# EAGLE design BillyBassBoard (EAGLE 9.6.2)

## Sheet 1 of 4
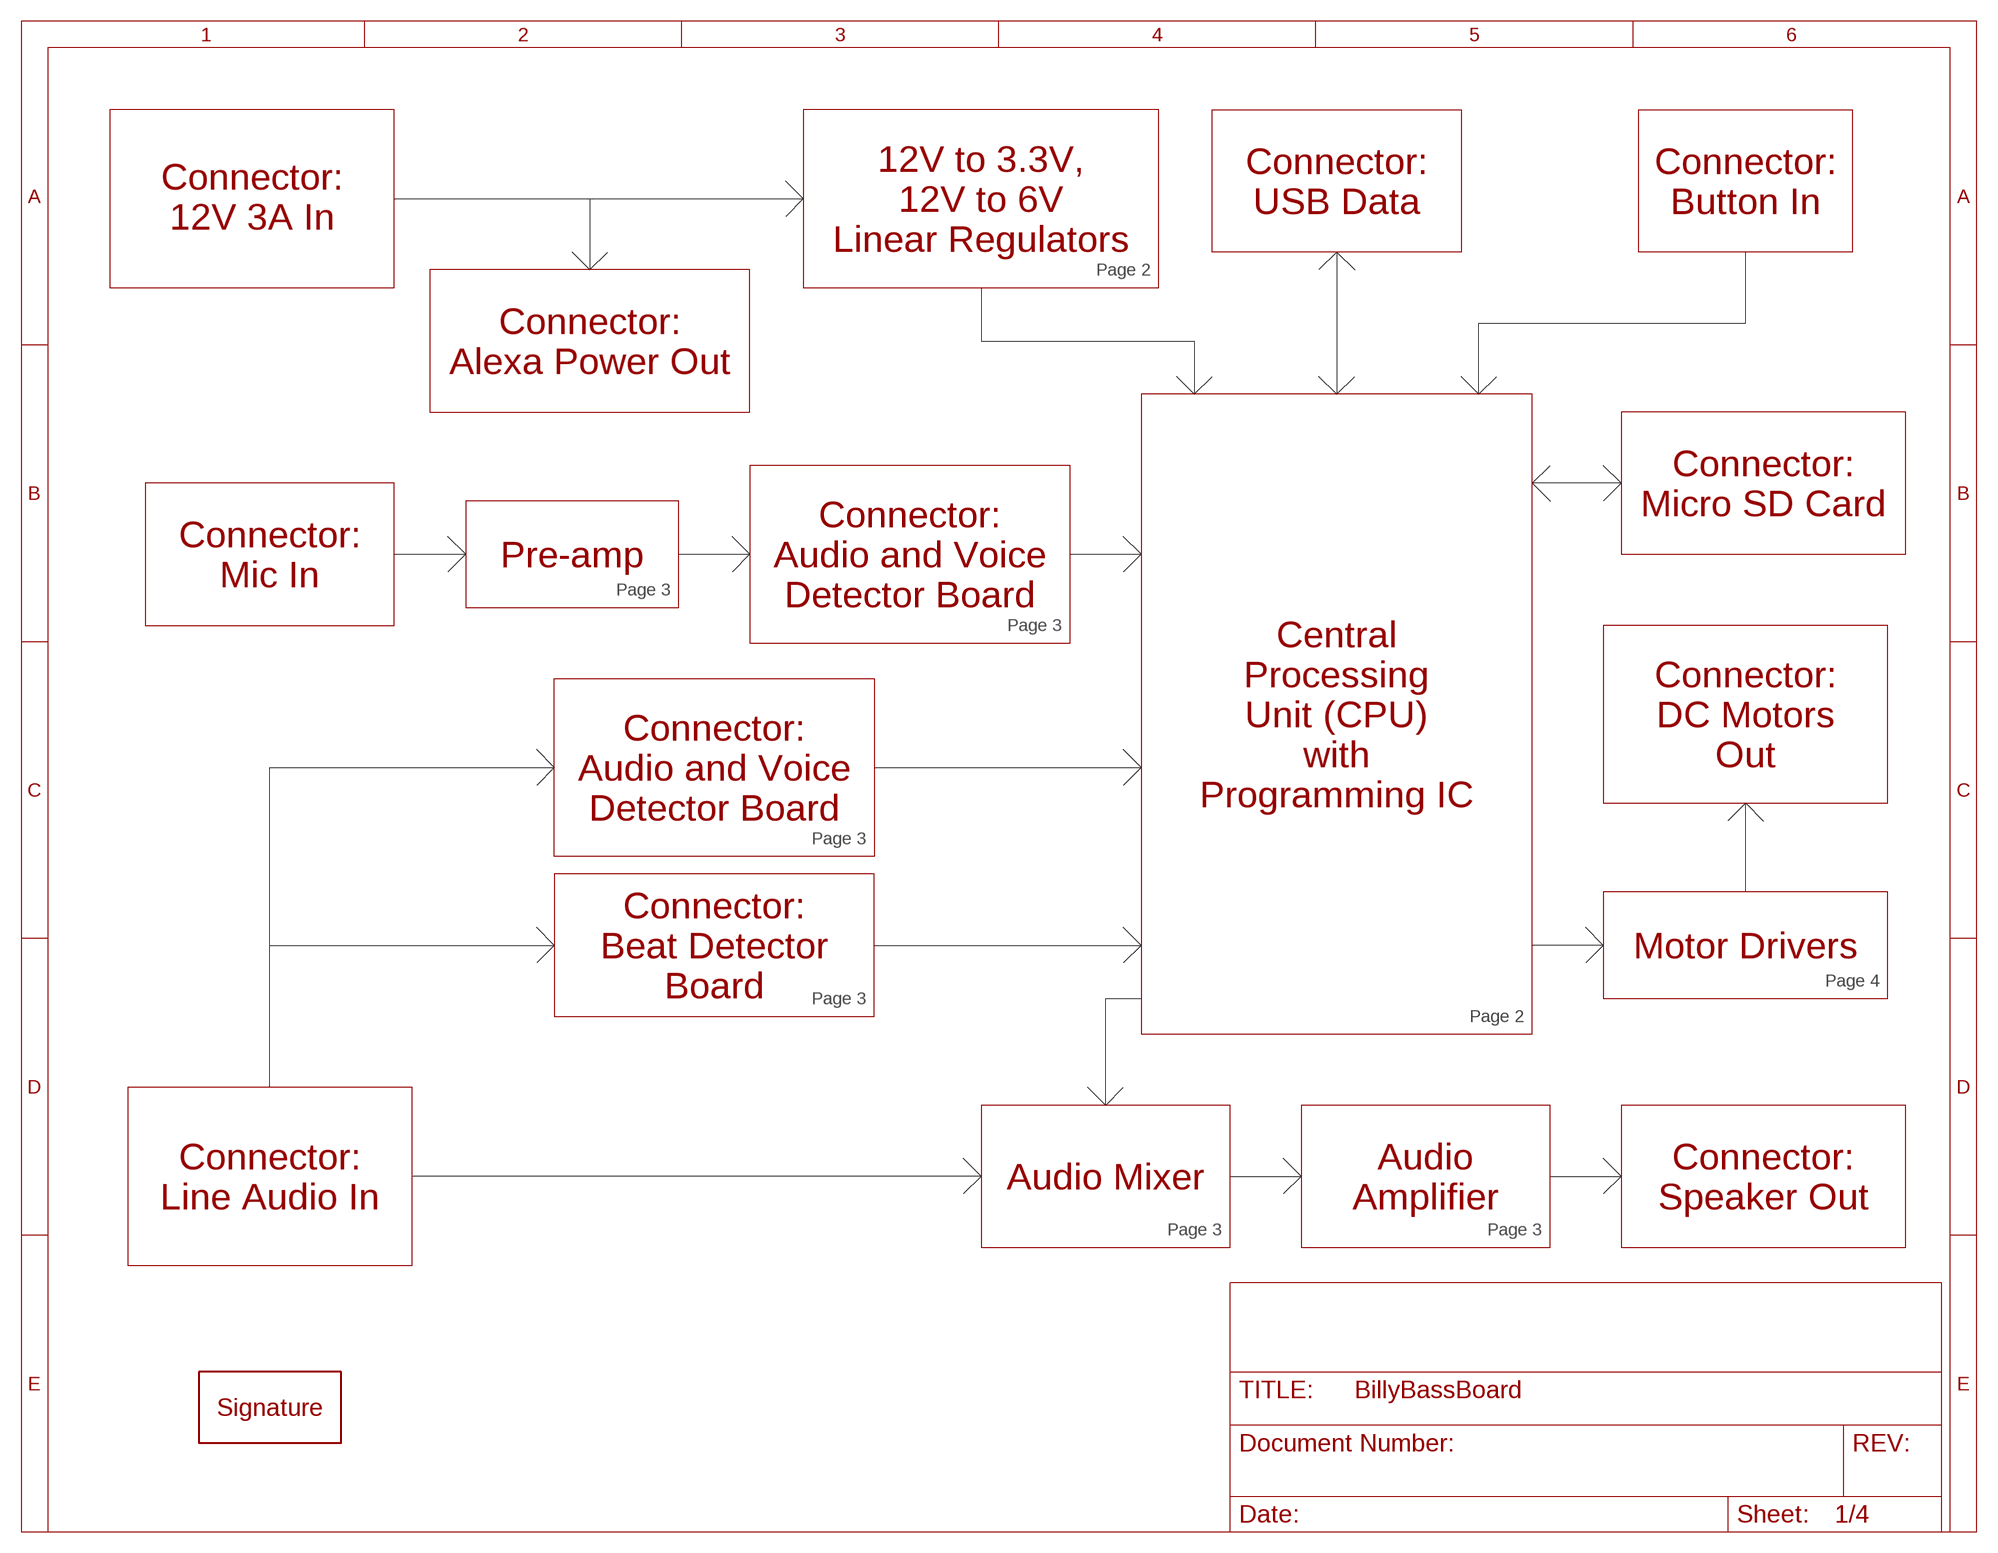
[diagram p0: schematic, sheet 1]

### Parts
U$122  SIGNATURE  [SIGNATURE]

### Notes on the sheet
- Connector:
  USB Data
- Connector:
  Button In
- 12V to 3.3V,
  12V to 6V
  Linear Regulators
- Connector:
  12V 3A In
- Page 2
- Connector:
  Alexa Power Out
- Connector:
  Micro SD Card
- Connector:
  Mic In
- Pre-amp
- Connector:
  Audio and Voice
  Detector Board
- Page 3
- Page 3
- Central
  Processing
  Unit (CPU)
  with
  Programming IC
- Connector:
  DC Motors
  Out
- Connector:
  Audio and Voice
  Detector Board
- Page 3
- Connector:
  Beat Detector
  Board
- Motor Drivers
- Page 4
- Page 3
- Page 2
- Connector:
  Line Audio In
- Audio Mixer
- Audio
  Amplifier
- Connector:
  Speaker Out
- Page 3 | Page 3

## Sheet 2 of 4
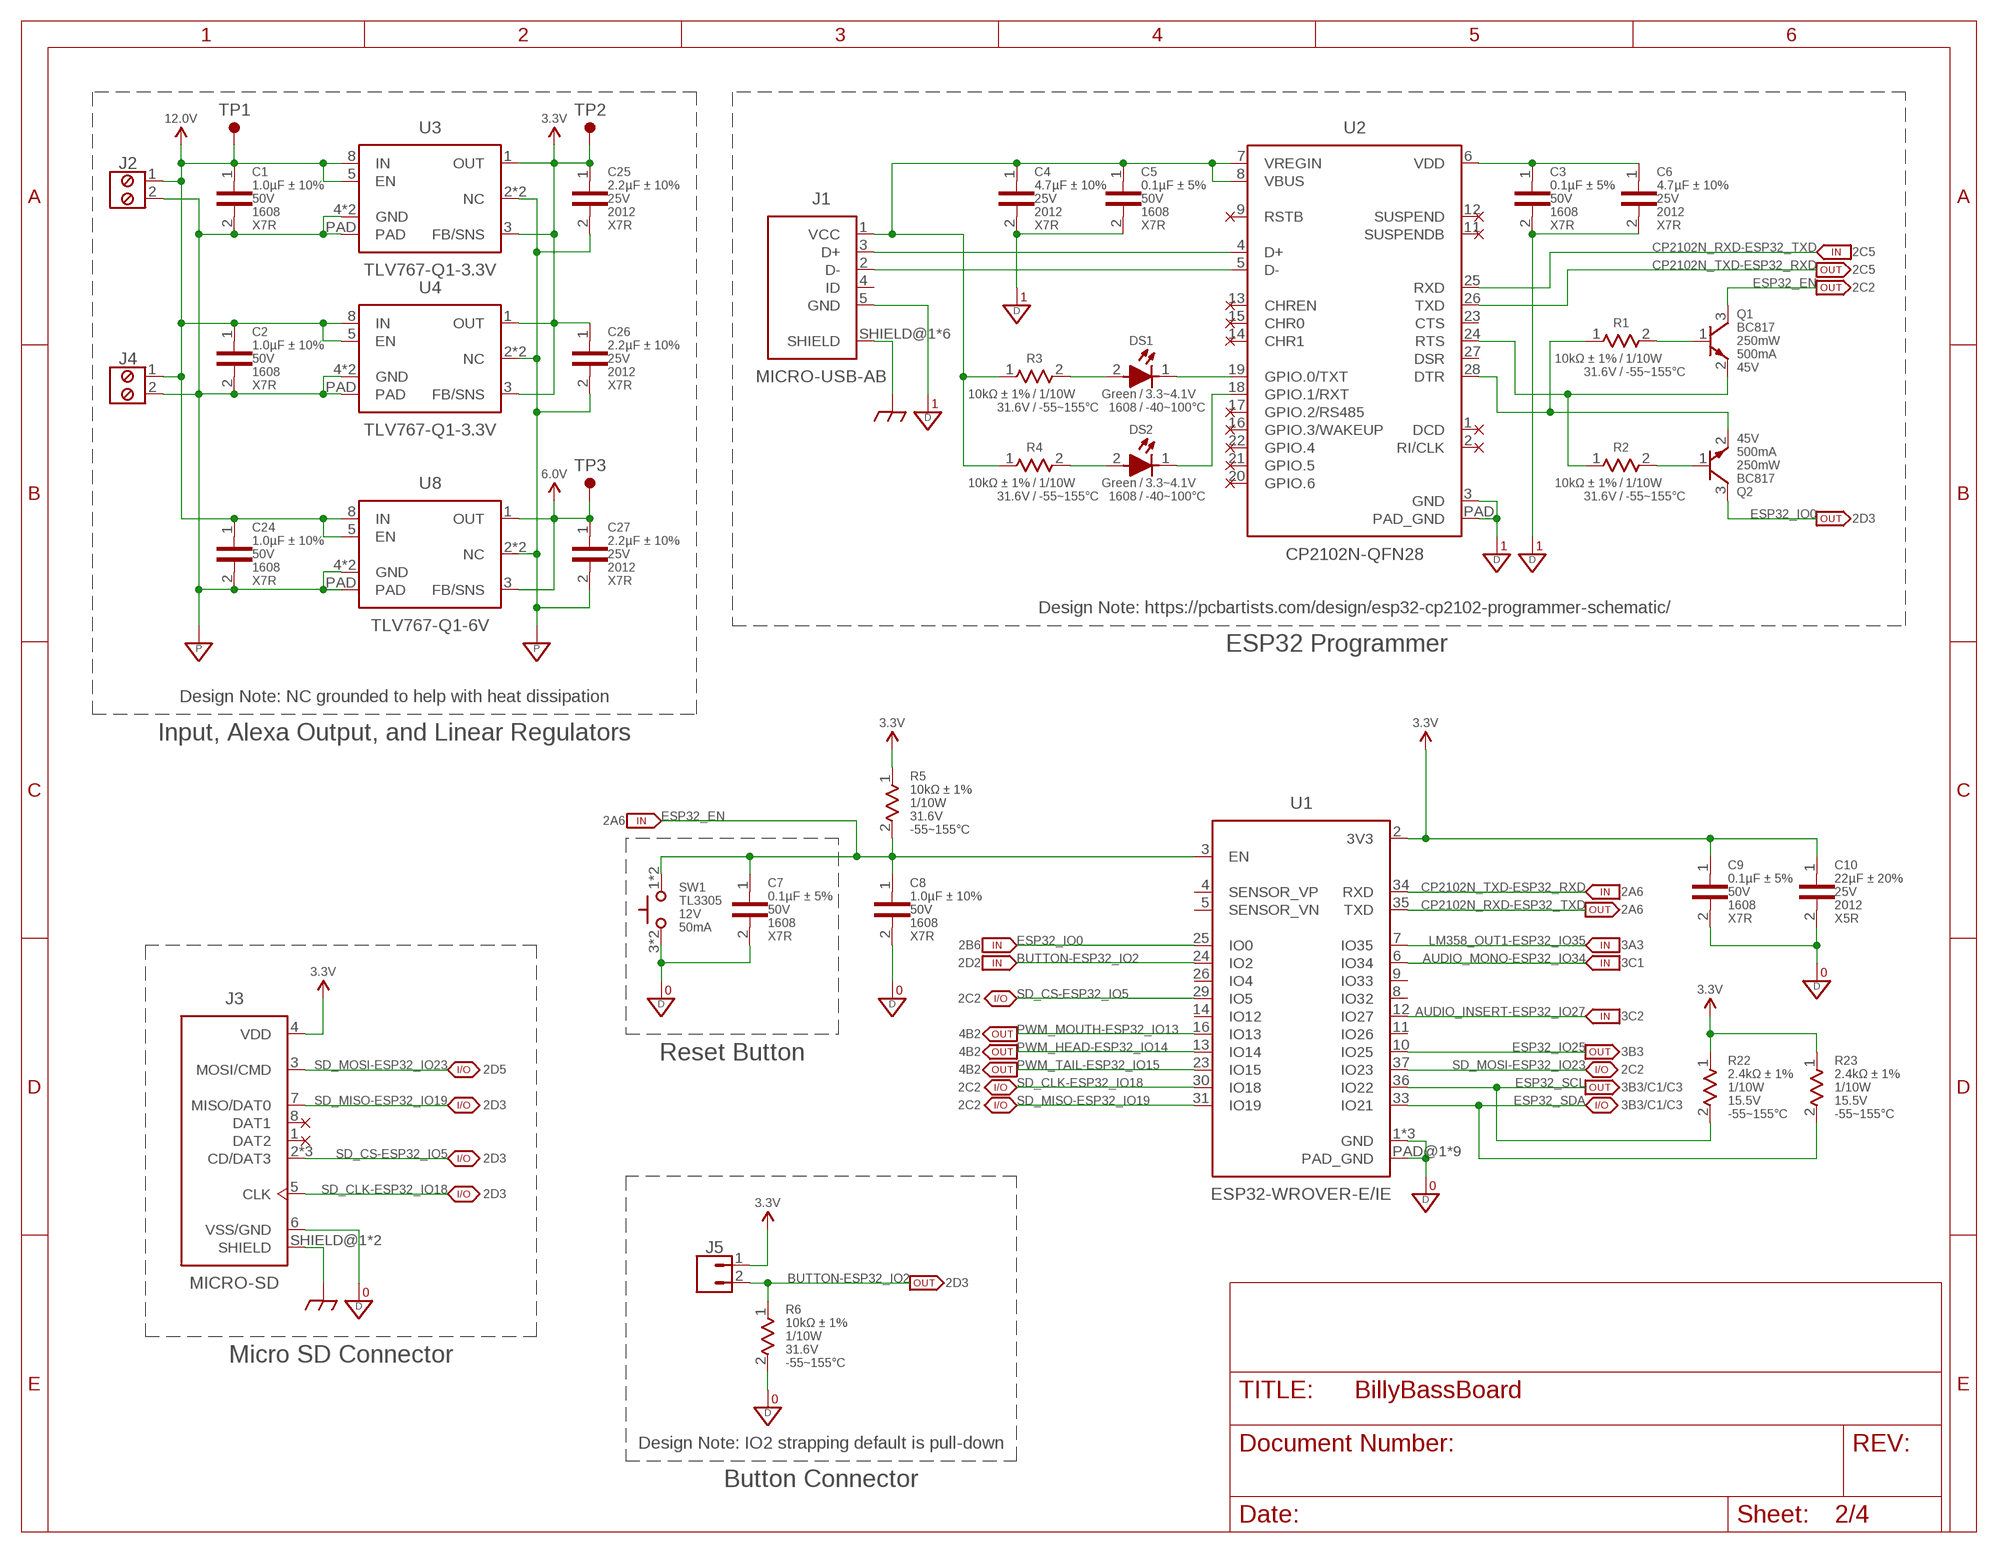
[diagram p1: schematic, sheet 2]

### Parts
C1  1.0µF ± 10%  CAP-V-1.0UF-1608  [1608-SEM]
C2  1.0µF ± 10%  CAP-V-1.0UF-1608  [1608-SEM]
C3  0.1µF ± 5%  CAP-V-0.1UF-1608  [1608-SEM]
C4  4.7µF ± 10%  CAP-V-4.7UF-2012  [2012-SEM]
C5  0.1µF ± 5%  CAP-V-0.1UF-1608  [1608-SEM]
C6  4.7µF ± 10%  CAP-V-4.7UF-2012  [2012-SEM]
C7  0.1µF ± 5%  CAP-V-0.1UF-1608  [1608-SEM]
C8  1.0µF ± 10%  CAP-V-1.0UF-1608  [1608-SEM]
C9  0.1µF ± 5%  CAP-V-0.1UF-1608  [1608-SEM]
C10  22µF ± 20%  CAP-V-22UF-2012  [2012-SEM]
C24  1.0µF ± 10%  CAP-V-1.0UF-1608  [1608-SEM]
C25  2.2µF ± 10%  CAP-V-2.2UF-2012  [2012-SEM]
C26  2.2µF ± 10%  CAP-V-2.2UF-2012  [2012-SEM]
C27  2.2µF ± 10%  CAP-V-2.2UF-2012  [2012-SEM]
DS1  Green  LED-H-GREEN-1608  [1608]
DS2  Green  LED-H-GREEN-1608  [1608]
J1  MICRO-USB-AB  [47589-0001]
J2  MPT-2-SCREW  [MPT-0.5/2-2.54]
J3  MICRO-SD  [MEM2061]
J4  MPT-2-SCREW  [MPT-0.5/2-2.54]
J5  JST-XH-2  [B2B-XH-A]
Q1  BC817  BJT-NPN-BC817  [SOT-23]
Q2  BC817  BJT-NPN-BC817  [SOT-23]
R1  10kΩ ± 1%  RES-H-10K-1608  [1608-SEM]
R2  10kΩ ± 1%  RES-H-10K-1608  [1608-SEM]
R3  10kΩ ± 1%  RES-H-10K-1608  [1608-SEM]
R4  10kΩ ± 1%  RES-H-10K-1608  [1608-SEM]
R5  10kΩ ± 1%  RES-V-10K-1608  [1608-SEM]
R6  10kΩ ± 1%  RES-V-10K-1608  [1608-SEM]
R22  2.4kΩ ± 1%  RES-V-2.4K-1608  [1608-SEM]
R23  2.4kΩ ± 1%  RES-V-2.4K-1608  [1608-SEM]
SW1  TL3305  BUTTON-V-SPST-TL3305  [TL3305]
TP1  TEST-POINT  [TEST-POINT]
TP2  TEST-POINT  [TEST-POINT]
TP3  TEST-POINT  [TEST-POINT]
U1  ESP32-WROVER-E/IE  [ESP32-WROVER-E/IE]
U2  CP2102N-QFN28  [QFN28]
U3  TLV767-Q1-3.3V  [VSON]
U4  TLV767-Q1-3.3V  [VSON]
U8  TLV767-Q1-6V  [VSON]

### Nets
3.3V: C9.1 C10.1 C25.1 C26.1 J3.4(VDD) J5.1 R5.1 R22.1 R23.1 TP2.TP U1.2(3V3) U3.1(OUT) U3.3(FB/SNS) U4.1(OUT) U4.3(FB/SNS) ; also sheet 3
6.0V: C27.1 TP3.TP U8.1(OUT) U8.3(FB/SNS) ; also sheet 3,4
12.0V: C1.1 C2.1 C24.1 J2.1 J4.1 TP1.TP U3.5(EN) U3.8(IN) U4.5(EN) U4.8(IN) U8.5(EN) U8.8(IN)
AUDIO_INSERT-ESP32_IO27: U1.12(IO27) ; also sheet 3
AUDIO_MONO-ESP32_IO34: U1.6(IO34) ; also sheet 3
BUTTON-ESP32_IO2: J5.2 R6.1 U1.24(IO2)
CHASSIS: J1.SHIELD@1(SHIELD) J1.SHIELD@2(SHIELD) J1.SHIELD@3(SHIELD) J1.SHIELD@4(SHIELD) J1.SHIELD@5(SHIELD) J1.SHIELD@6(SHIELD) J3.SHIELD@1(SHIELD) J3.SHIELD@2(SHIELD) ; also sheet 3
CP2102N_D+: J1.3(D+) U2.4(D+)
CP2102N_D-: J1.2(D-) U2.5(D-)
CP2102N_DTR: Q2.2(E) R1.1 U2.28(DTR)
CP2102N_RTS: Q1.2(E) R2.1 U2.24(RTS)
CP2102N_RXD-ESP32_TXD: U1.35(TXD) U2.25(RXD)
CP2102N_RXT: DS2.1 U2.18(GPIO.1/RXT)
CP2102N_TXD-ESP32_RXD: U1.34(RXD) U2.26(TXD)
CP2102N_TXT: DS1.1 U2.19(GPIO.0/TXT)
CP2102N_VBUS: C4.1 C5.1 J1.1(VCC) R3.1 R4.1 U2.7(VREGIN) U2.8(VBUS)
CP2102N_VDD: C3.1 C6.1 U2.6(VDD)
DGND-0: C7.2 C8.2 C9.2 C10.2 J3.6(VSS/GND) R6.2 SW1.3 SW1.4 U1.1(GND) U1.15(GND) U1.38(GND) U1.PAD@1(PAD_GND) U1.PAD@2(PAD_GND) U1.PAD@3(PAD_GND) U1.PAD@4(PAD_GND) U1.PAD@5(PAD_GND) U1.PAD@6(PAD_GND) U1.PAD@7(PAD_GND) U1.PAD@8(PAD_GND) U1.PAD@9(PAD_GND) ; also sheet 3,4
DGND-1: C3.2 C4.2 C5.2 C6.2 J1.5(GND) U2.3(GND) U2.PAD(PAD_GND) ; also sheet 3
ESP32_EN: C7.1 C8.1 Q1.3(C) R5.2 SW1.1 SW1.2 U1.3(EN)
ESP32_IO0: Q2.3(C) U1.25(IO0)
ESP32_IO25: U1.10(IO25) ; also sheet 3
ESP32_SCL: R22.2 U1.36(IO22) ; also sheet 3
ESP32_SDA: R23.2 U1.33(IO21) ; also sheet 3
LM358_OUT1-ESP32_IO35: U1.7(IO35) ; also sheet 3
N$3: Q1.1(B) R1.2
N$4: Q2.1(B) R2.2
N$5: DS1.2 R3.2
N$6: DS2.2 R4.2
PGND: C1.2 C2.2 C24.2 C25.2 C26.2 C27.2 J2.2 J4.2 U3.2(NC) U3.4(GND) U3.6(GND) U3.7(NC) U3.PAD U4.2(NC) U4.4(GND) U4.6(GND) U4.7(NC) U4.PAD U8.2(NC) U8.4(GND) U8.6(GND) U8.7(NC) U8.PAD ; also sheet 3,4
PWM_HEAD-ESP32_IO14: U1.13(IO14) ; also sheet 4
PWM_MOUTH-ESP32_IO13: U1.16(IO13) ; also sheet 4
PWM_TAIL-ESP32_IO15: U1.23(IO15) ; also sheet 4
SD_CLK-ESP32_IO18: J3.5(CLK) U1.30(IO18)
SD_CS-ESP32_IO5: J3.2(CD/DAT3) J3.CD@1(CD/DAT3) J3.CD@2(CD/DAT3) U1.29(IO5)
SD_MISO-ESP32_IO19: J3.7(MISO/DAT0) U1.31(IO19)
SD_MOSI-ESP32_IO23: J3.3(MOSI/CMD) U1.37(IO23)
Unconnected: J1.4(ID) J3.1(DAT2) J3.8(DAT1) U1.4(SENSOR_VP) U1.5(SENSOR_VN) U1.8(IO32) U1.9(IO33) U1.11(IO26) U1.14(IO12) U1.26(IO4) U2.1(DCD) U2.2(RI/CLK) U2.9(RSTB) U2.11(SUSPENDB) U2.12(SUSPEND) U2.13(CHREN) U2.14(CHR1) U2.15(CHR0) U2.16(GPIO.3/WAKEUP) U2.17(GPIO.2/RS485) U2.20(GPIO.6) U2.21(GPIO.5) U2.22(GPIO.4) U2.23(CTS) U2.27(DSR)

### Notes on the sheet
- 2C5
- 2C5
- 2C2
- 2D3
- Design Note: https://pcbartists.com/design/esp32-cp2102-programmer-schematic/
- ESP32 Programmer
- Design Note: NC grounded to help with heat dissipation
- Input, Alexa Output, and Linear Regulators
- 2A6
- 2A6
- 2A6
- 2B6 | 3A3
- 2D2 | 3C1
- 2C2
- 3C2
- 4B2
- Reset Button | 4B2 | 3B3
- 2D5 | 4B2 | 2C2
- 2C2 | 3B3/C1/C3
- 2D3 | 2C2 | 3B3/C1/C3
- 2D3
- 2D3
- 2D3
- Micro SD Connector
- Design Note: IO2 strapping default is pull-down
- Button Connector

## Sheet 3 of 4
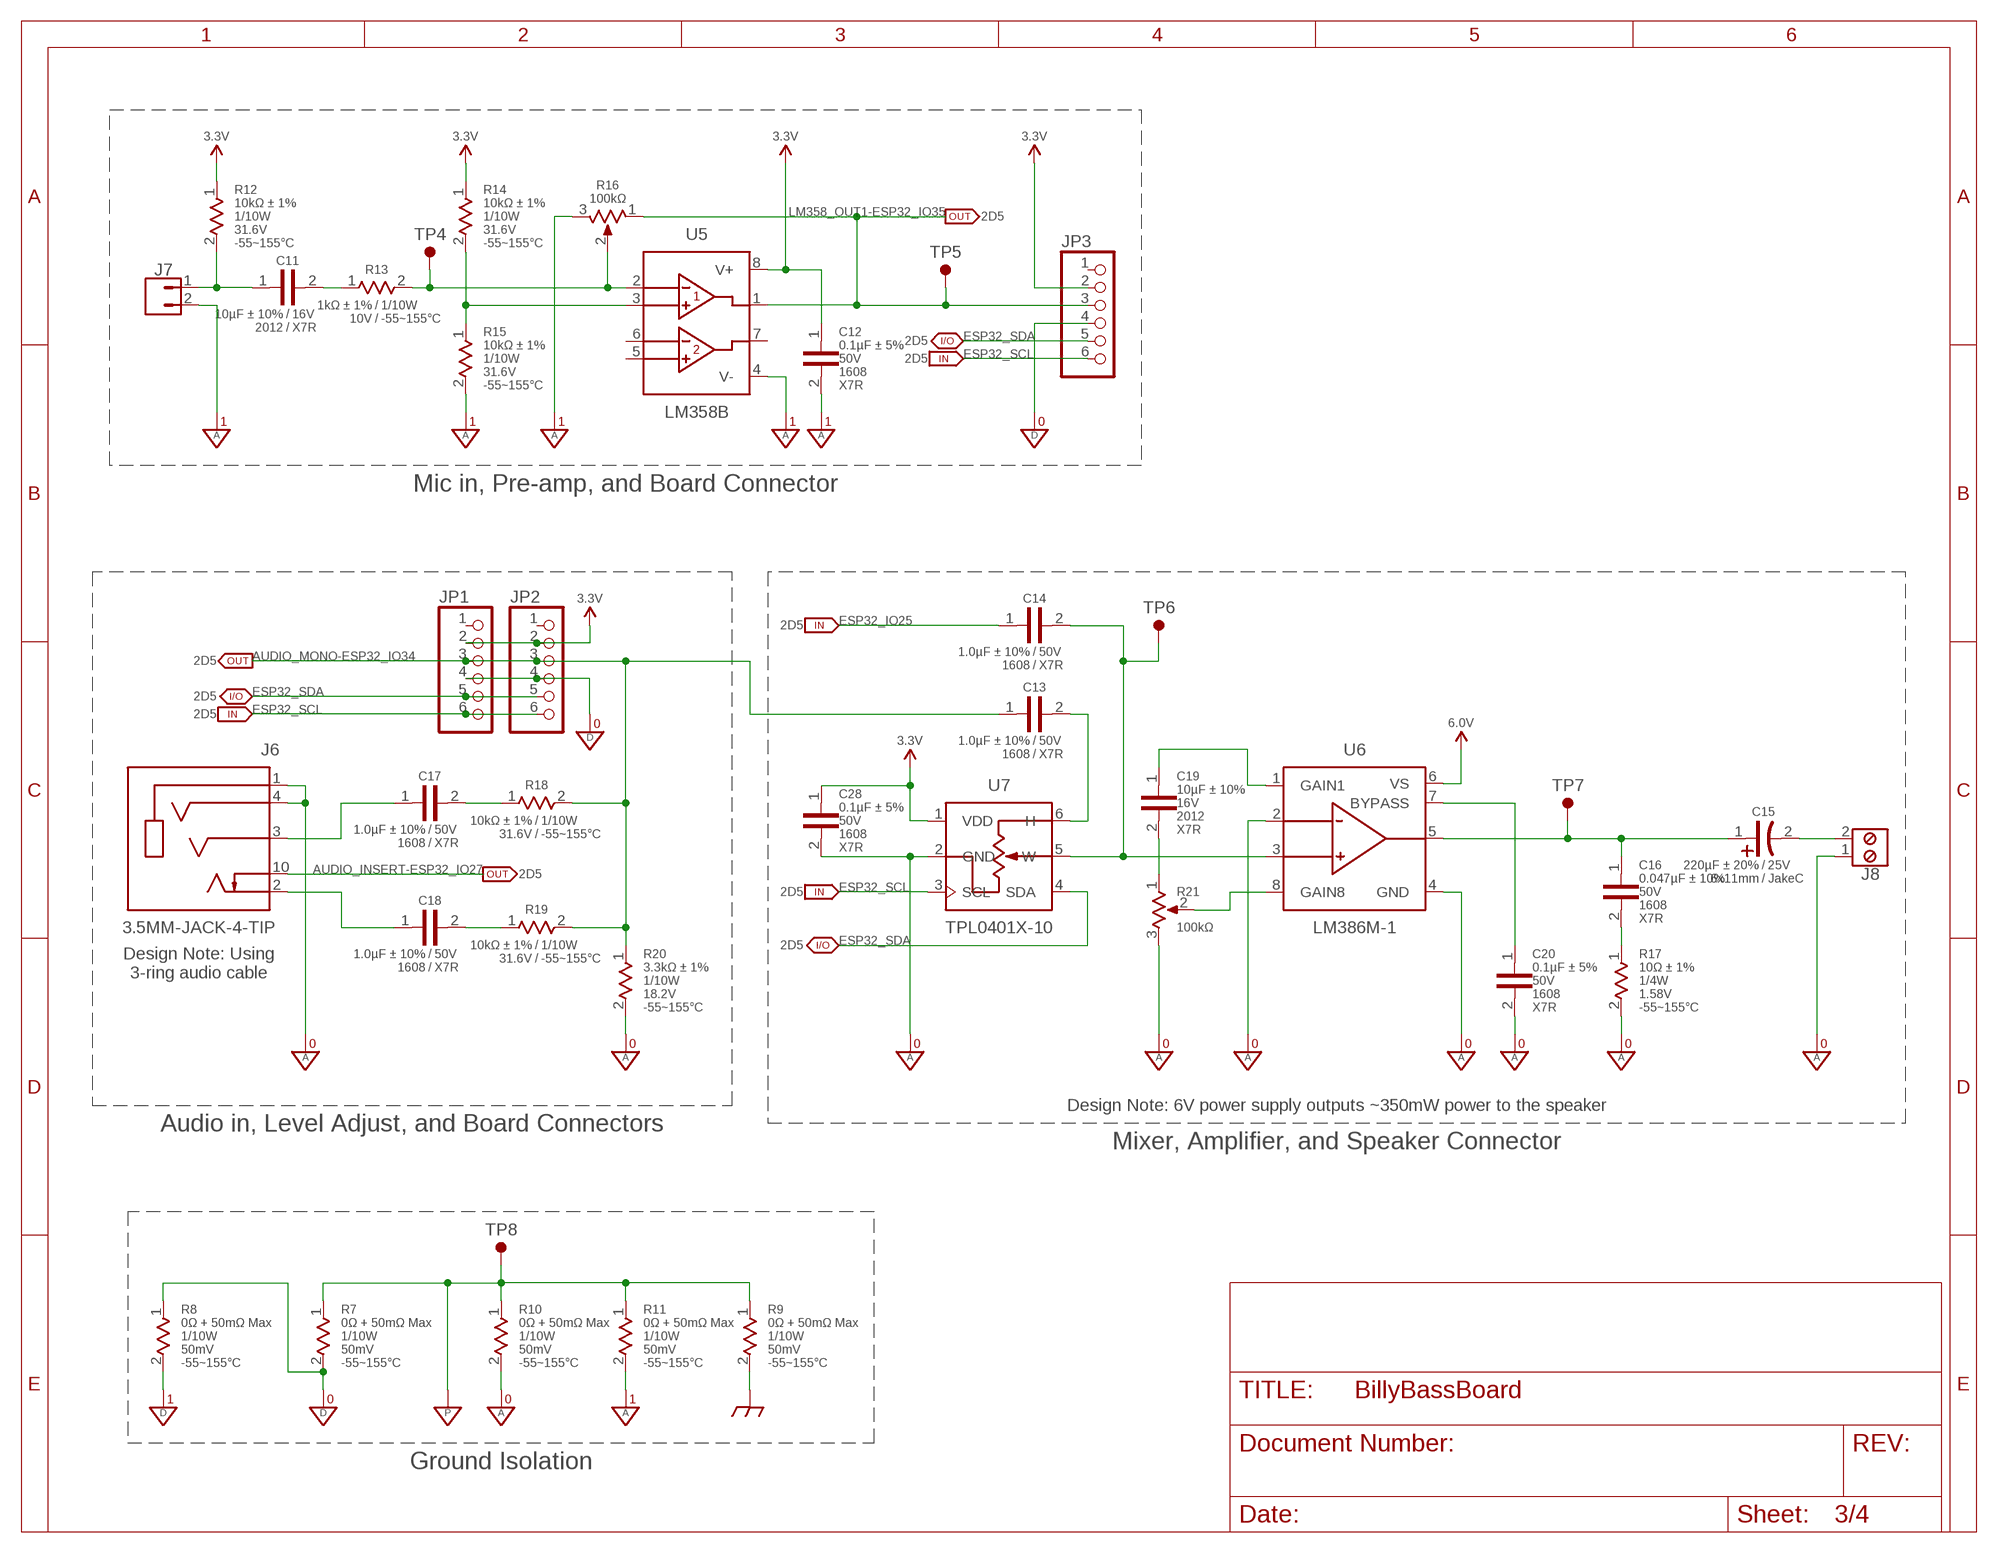
[diagram p2: schematic, sheet 3]

### Parts
C11  10µF ± 10%  CAP-H-10UF-2012  [2012-SEM]
C12  0.1µF ± 5%  CAP-V-0.1UF-1608  [1608-SEM]
C13  1.0µF ± 10%  CAP-H-1.0UF-1608  [1608-SEM]
C14  1.0µF ± 10%  CAP-H-1.0UF-1608  [1608-SEM]
C15  220µF ± 20%  CAP-H-POL-220UF-6X11-E-FLAT-REV  [6X11-E-FLAT-REV]
C16  0.047µF ± 10%  CAP-V-0.047UF-1608  [1608-SEM]
C17  1.0µF ± 10%  CAP-H-1.0UF-1608  [1608-SEM]
C18  1.0µF ± 10%  CAP-H-1.0UF-1608  [1608-SEM]
C19  10µF ± 10%  CAP-V-10UF-2012  [2012-SEM]
C20  0.1µF ± 5%  CAP-V-0.1UF-1608  [1608-SEM]
C28  0.1µF ± 5%  CAP-V-0.1UF-1608  [1608-SEM]
J6  3.5MM-JACK-4-TIP  [SJ2-358940-SMT]
J7  JST-XH-2  [B2B-XH-A]
J8  MPT-2-SCREW  [MPT-0.5/2-2.54]
JP1  PINHD-1X6  [1X06]
JP2  PINHD-1X6  [1X06]
JP3  PINHD-1X6  [1X06]
R7  0Ω + 50mΩ Max  RES-V-0R-1608  [1608-SEM]
R8  0Ω + 50mΩ Max  RES-V-0R-1608  [1608-SEM]
R9  0Ω + 50mΩ Max  RES-V-0R-1608  [1608-SEM]
R10  0Ω + 50mΩ Max  RES-V-0R-1608  [1608-SEM]
R11  0Ω + 50mΩ Max  RES-V-0R-1608  [1608-SEM]
R12  10kΩ ± 1%  RES-V-10K-1608  [1608-SEM]
R13  1kΩ ± 1%  RES-H-1K-1608  [1608-SEM]
R14  10kΩ ± 1%  RES-V-10K-1608  [1608-SEM]
R15  10kΩ ± 1%  RES-V-10K-1608  [1608-SEM]
R16  100kΩ  TRIMPOT-H-100K  [3314J]
R17  10Ω ± 1%  RES-V-10R-3216  [3216-SEM]
R18  10kΩ ± 1%  RES-H-10K-1608  [1608-SEM]
R19  10kΩ ± 1%  RES-H-10K-1608  [1608-SEM]
R20  3.3kΩ ± 1%  RES-V-3.3K-1608  [1608-SEM]
R21  100kΩ  TRIMPOT-V-100K  [3314J]
TP4  TEST-POINT  [TEST-POINT]
TP5  TEST-POINT  [TEST-POINT]
TP6  TEST-POINT  [TEST-POINT]
TP7  TEST-POINT  [TEST-POINT]
TP8  TEST-POINT  [TEST-POINT]
U5  LM358B  [D0008A-SOIC]
U6  LM386M-1  [D0008A-SOIC]
U7  TPL0401X-10  [SC70]

### Nets
3.3V: C12.1 C28.1 JP1.2 JP2.2 JP3.2 R12.1 R14.1 U5.8(V+) U7.1(VDD) ; also sheet 2
6.0V: U6.6(VS) ; also sheet 2,4
AGND-0: C20.2 C28.2 J6.1(SLEEVE) J6.4(RING_2) J8.1 R10.2 R17.2 R20.2 R21.3 U6.2(-INPUT) U6.4(GND) U7.2(GND)
AGND-1: C12.2 J7.2 R11.2 R15.2 R16.3 U5.4(V-)
AUDIO_INSERT-ESP32_IO27: J6.10(TIP_SWITCH) ; also sheet 2
AUDIO_LEFT: C18.1 J6.2(TIP)
AUDIO_MONO-ESP32_IO34: C13.1 JP1.3 JP2.3 R18.2 R19.2 R20.1 ; also sheet 2
AUDIO_RIGHT: C17.1 J6.3(RING_1)
CHASSIS: R9.2 ; also sheet 2
DGND-0: JP1.4 JP2.4 JP3.4 R7.2 R8.1 ; also sheet 2,4
DGND-1: R8.2 ; also sheet 2
ESP32_IO25: C14.1 ; also sheet 2
ESP32_SCL: JP1.6 JP2.6 JP3.6 U7.3(SCL) ; also sheet 2
ESP32_SDA: JP1.5 JP2.5 JP3.5 U7.4(SDA) ; also sheet 2
LM358_IN1+: R14.2 R15.1 U5.3(IN1+)
LM358_IN1-: R13.2 R16.2 TP4.TP U5.2(IN1-)
LM358_OUT1-ESP32_IO35: JP3.3 R16.1 TP5.TP U5.1(OUT1) ; also sheet 2
LM386M-G1: C19.1 U6.1(GAIN1)
LM386M_BYPASS: C20.1 U6.7(BYPASS)
LM386M_G8: R21.2 U6.8(GAIN8)
LM386M_IN+: C14.2 TP6.TP U6.3(+INPUT) U7.5(W)
LM386M_OUT: C15.1 C16.1 TP7.TP U6.5(VOUT)
MIC+: C11.1 J7.1 R12.2
N$10: C11.2 R13.1
N$15: C16.2 R17.1
N$17: C17.2 R18.1
N$18: C18.2 R19.1
N$21: C19.2 R21.1
PGND: R7.1 R9.1 R10.1 R11.1 TP8.TP ; also sheet 2,4
SPEAKER+: C15.2 J8.2
TPL0401_H: C13.2 U7.6(H)
Unconnected: JP1.1 JP2.1 JP3.1 U5.5(IN2+) U5.6(IN2-) U5.7(OUT2)

### Notes on the sheet
- 2D5
- 2D5
- 2D5
- Mic in, Pre-amp, and Board Connector
- 2D5
- 2D5
- 2D5
- 2D5
- 2D5
- 2D5
- 2D5
- Design Note: Using
  3-ring audio cable
- Design Note: 6V power supply outputs ~350mW power to the speaker
- Audio in, Level Adjust, and Board Connectors
- Mixer, Amplifier, and Speaker Connector
- Ground Isolation

## Sheet 4 of 4
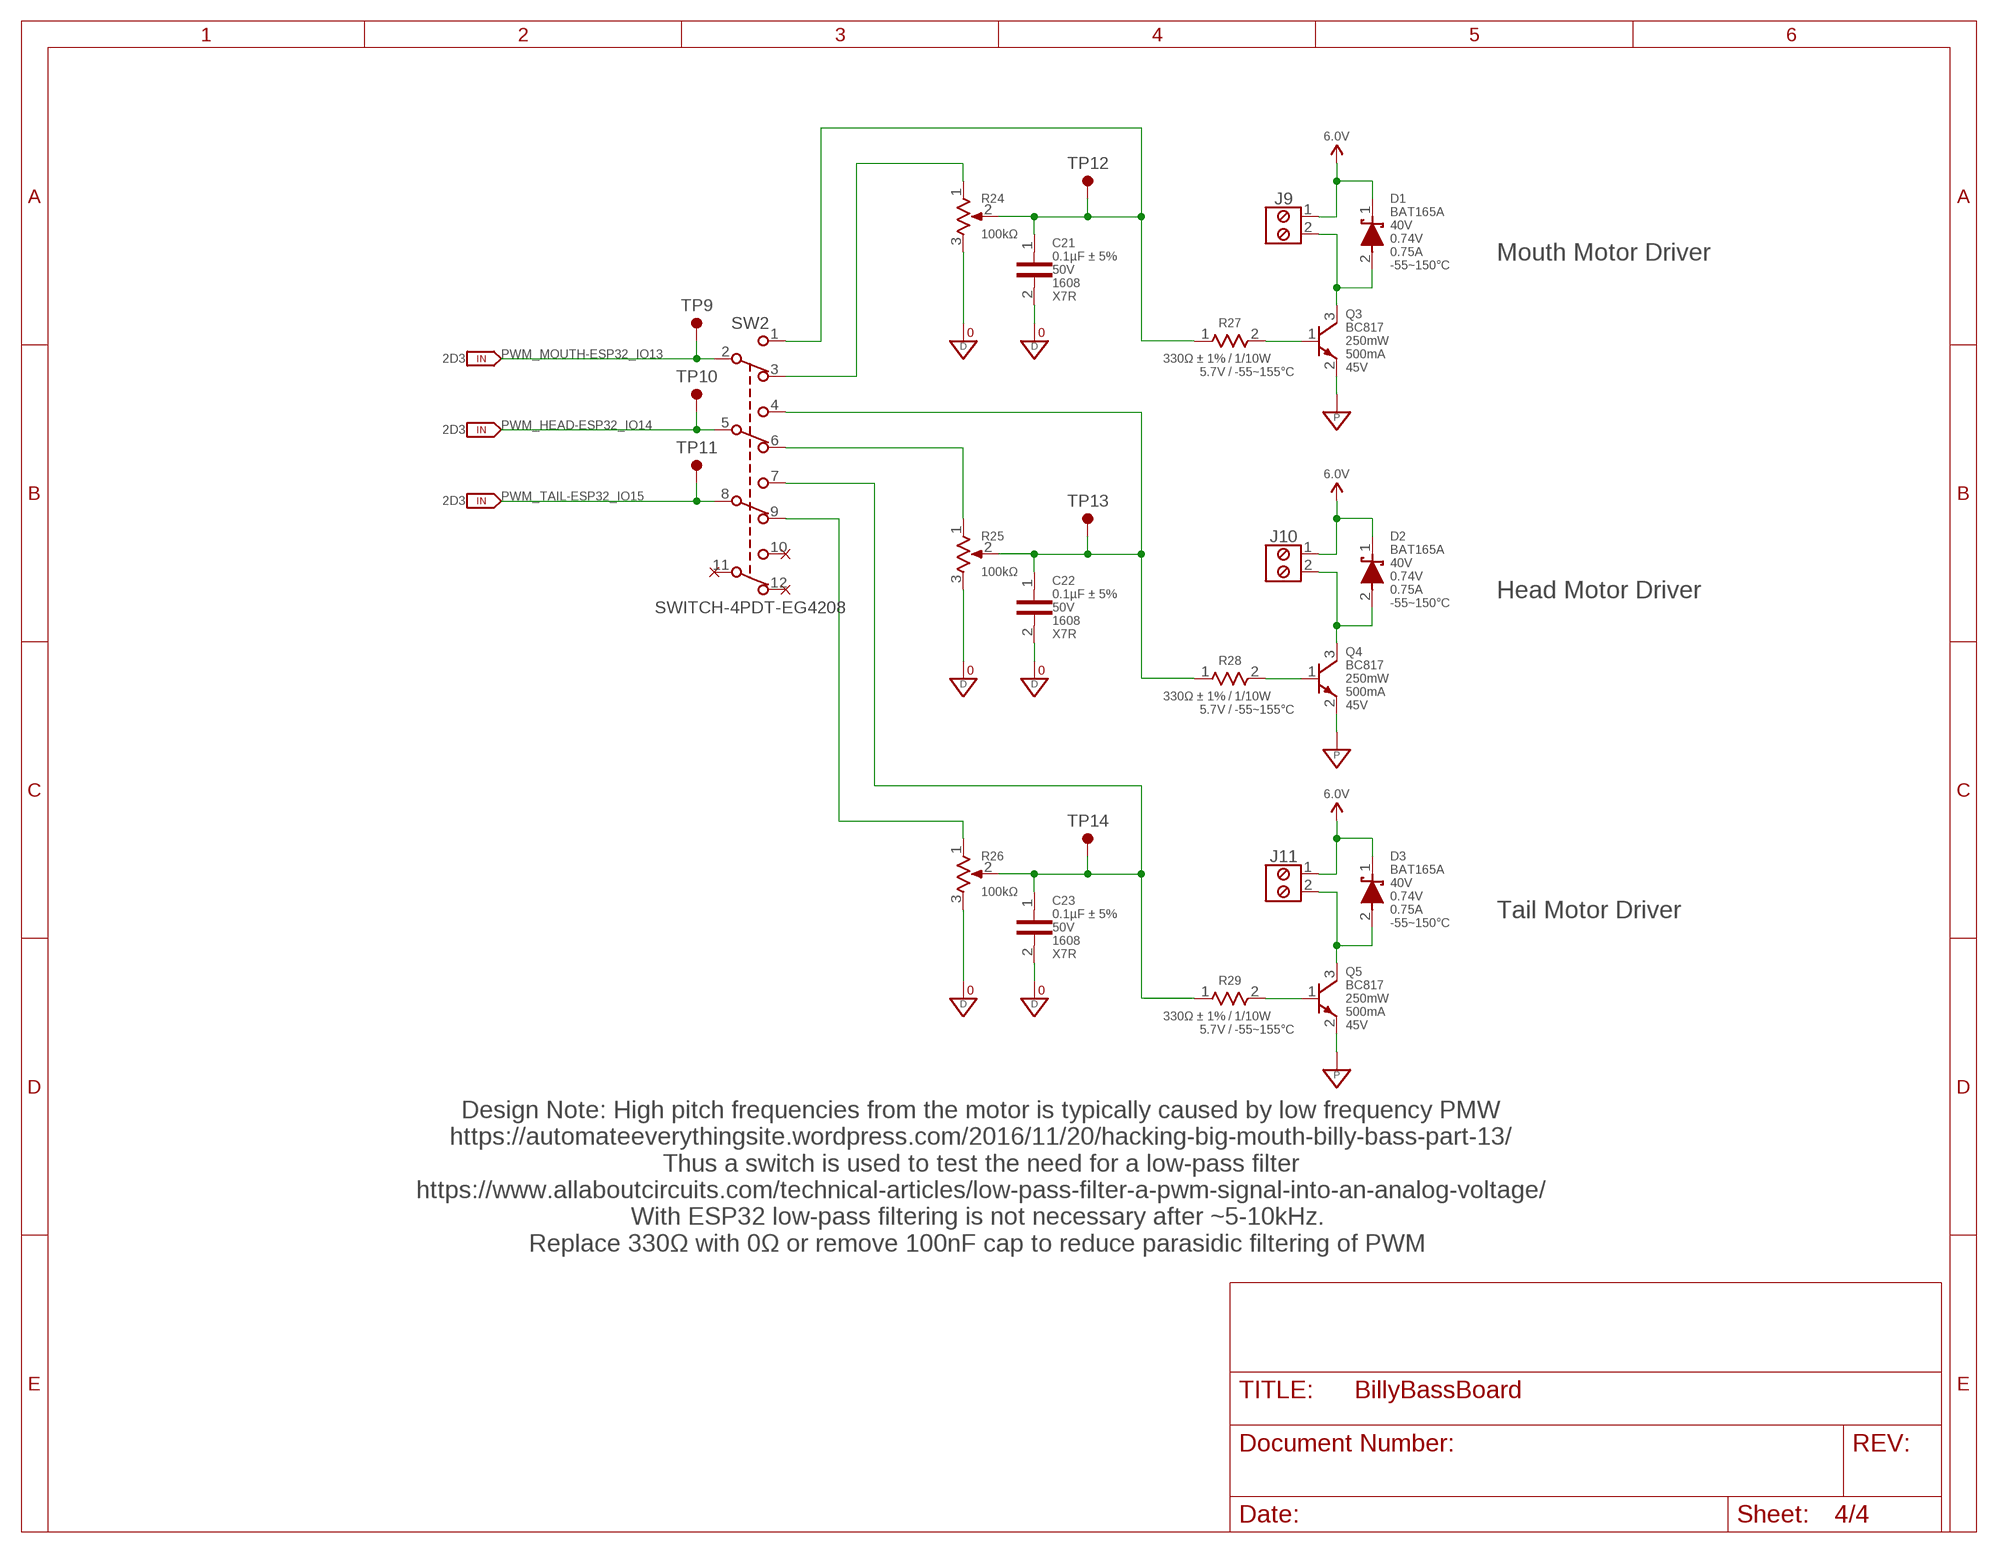
[diagram p3: schematic, sheet 4]

### Parts
C21  0.1µF ± 5%  CAP-V-0.1UF-1608  [1608-SEM]
C22  0.1µF ± 5%  CAP-V-0.1UF-1608  [1608-SEM]
C23  0.1µF ± 5%  CAP-V-0.1UF-1608  [1608-SEM]
D1  BAT165A  SCHOTTKY-V-BAT165A-SOD323  [SOD323]
D2  BAT165A  SCHOTTKY-V-BAT165A-SOD323  [SOD323]
D3  BAT165A  SCHOTTKY-V-BAT165A-SOD323  [SOD323]
J9  MPT-2-SCREW  [MPT-0.5/2-2.54]
J10  MPT-2-SCREW  [MPT-0.5/2-2.54]
J11  MPT-2-SCREW  [MPT-0.5/2-2.54]
Q3  BC817  BJT-NPN-BC817  [SOT-23]
Q4  BC817  BJT-NPN-BC817  [SOT-23]
Q5  BC817  BJT-NPN-BC817  [SOT-23]
R24  100kΩ  TRIMPOT-V-100K  [3314J]
R25  100kΩ  TRIMPOT-V-100K  [3314J]
R26  100kΩ  TRIMPOT-V-100K  [3314J]
R27  330Ω ± 1%  RES-H-330R-1608  [1608-SEM]
R28  330Ω ± 1%  RES-H-330R-1608  [1608-SEM]
R29  330Ω ± 1%  RES-H-330R-1608  [1608-SEM]
SW2  SWITCH-4PDT-EG4208  [EG4208]
TP9  TEST-POINT  [TEST-POINT]
TP10  TEST-POINT  [TEST-POINT]
TP11  TEST-POINT  [TEST-POINT]
TP12  TEST-POINT  [TEST-POINT]
TP13  TEST-POINT  [TEST-POINT]
TP14  TEST-POINT  [TEST-POINT]

### Nets
6.0V: D1.1 D2.1 D3.1 J9.1 J10.1 J11.1 ; also sheet 2,3
DGND-0: C21.2 C22.2 C23.2 R24.3 R25.3 R26.3 ; also sheet 2,3
DRIVE_SIGNAL_HEAD: C22.1 R25.2 R28.1 SW2.4 TP13.TP
DRIVE_SIGNAL_MOUTH: C21.1 R24.2 R27.1 SW2.1 TP12.TP
DRIVE_SIGNAL_TAIL: C23.1 R26.2 R29.1 SW2.7 TP14.TP
HEAD-: D2.2 J10.2 Q4.3(C)
MOUTH-: D1.2 J9.2 Q3.3(C)
N$16: Q3.1(B) R27.2
N$20: Q4.1(B) R28.2
N$23: Q5.1(B) R29.2
PGND: Q3.2(E) Q4.2(E) Q5.2(E) ; also sheet 2,3
PWM_HEAD: R25.1 SW2.6
PWM_HEAD-ESP32_IO14: SW2.5 TP10.TP ; also sheet 2
PWM_MOUTH: R24.1 SW2.3
PWM_MOUTH-ESP32_IO13: SW2.2 TP9.TP ; also sheet 2
PWM_TAIL: R26.1 SW2.9
PWM_TAIL-ESP32_IO15: SW2.8 TP11.TP ; also sheet 2
TAIL-: D3.2 J11.2 Q5.3(C)
Unconnected: SW2.10 SW2.11 SW2.12

### Notes on the sheet
- Mouth Motor Driver
- 2D3
- 2D3
- 2D3
- Head Motor Driver
- Tail Motor Driver
- Design Note: High pitch frequencies from the motor is typically caused by low frequency PMW
  https://automateeverythingsite.wordpress.com/2016/11/20/hacking-big-mouth-billy-bass-part-13/
  Thus a switch is used to test the need for a low-pass filter
  https://www.allaboutcircuits.com/technical-articles/low-pass-filter-a-pwm-signal-into-an-analog-voltage/
  With ESP32 low-pass filtering is not necessary after ~5-10kHz. 
  Replace 330Ω with 0Ω or remove 100nF cap to reduce parasidic filtering of PWM

## Library data of the parts
C1-C3 C5 C7-C9 C12 C16 C20-C24 C28 = Harrington-Capacitors:CAP-V: Ceramic Capacitors - Vertical; SIZE: 1608; TEMPERATURE: X7R; VOLTAGE: 50V
C4 C6 C25-C27 = Harrington-Capacitors:CAP-V: Ceramic Capacitors - Vertical; SIZE: 2012; TEMPERATURE: X7R; VOLTAGE: 25V
C10 = Harrington-Capacitors:CAP-V: Ceramic Capacitors - Vertical; SIZE: 2012; TEMPERATURE: X5R; VOLTAGE: 25V
C11 = Harrington-Capacitors:CAP-H: Ceramic Capacitors SEM - Horizontal; SIZE: 2012; TEMPERATURE: X7R; VOLTAGE: 16V
C13 C14 C17 C18 = Harrington-Capacitors:CAP-H: Ceramic Capacitors SEM - Horizontal; SIZE: 1608; TEMPERATURE: X7R; VOLTAGE: 50V
C15 = Harrington-Capacitors:CAP-H-POL: Polarized Capacitors - Horizontal; SIZE: 6x11mm; TEMPERATURE: JakeC; VOLTAGE: 25V
C19 = Harrington-Capacitors:CAP-V: Ceramic Capacitors - Vertical; SIZE: 2012; TEMPERATURE: X7R; VOLTAGE: 16V
D1-D3 = Harrington-Diodes:SCHOTTKY-V: Schottky Diodes Nexperia - Vertical - Low forward voltage drop; I_MAX: 0.75A; TEMPERATURE: -55~150°C; VF_MAX: 0.74V; VR_MAX: 40V
DS1 DS2 = Harrington-LEDs:LED-H: LEDs Kingbright - Horizontal; SIZE: 1608; TEMPERATURE: -40~100°C; VOLTAGE: 3.3~4.1V
J1 = Harrington-Connectors:MICRO-USB-AB: Micro USB AB Molex
J2 J4 J8-J11 = Harrington-Connectors:MPT-2-SCREW: 2-pin MPT Screw Connector Phoenix Contact - Max Voltage: 160V - Max Current: 6A
J3 = Harrington-Connectors:MICRO-SD: Micro-SD Connector GCT - CD = GND when not inserted
J5 J7 = Harrington-Connectors:JST-XH-2: 2-pin XH Connector JST - Max Voltage: 250V - Max Current: 3A
J6 = Harrington-Connectors:3.5MM-JACK-4-TIP: 4-pin 3.5mm Jack with tip swtich CUI Devices - Max Voltage: 12V - Max Current: 1A
JP1-JP3 = pinhead:PINHD-1X6: PIN HEADER
Q1-Q5 = Harrington-Transistors:BJT-NPN: NPN BJTs; IC_MAX: 500mA; POWER: 250mW; VCE_MAX: 45V
R1-R4 R18 R19 = Harrington-Resistors:RES-H: Resistors - Horizontal; POWER: 1/10W; TEMPERATURE: -55~155°C; VOLTAGE: 31.6V
R5 R6 R12 R14 R15 = Harrington-Resistors:RES-V: Resistors - Vertical; POWER: 1/10W; TEMPERATURE: -55~155°C; VOLTAGE: 31.6V
R7-R11 = Harrington-Resistors:RES-V: Resistors - Vertical; POWER: 1/10W; TEMPERATURE: -55~155°C; VOLTAGE: 50mV
R13 = Harrington-Resistors:RES-H: Resistors - Horizontal; POWER: 1/10W; TEMPERATURE: -55~155°C; VOLTAGE: 10V
R16 = Harrington-Resistors:TRIMPOT-H: Trimming Potentiometers Bourns - Horizontal
R17 = Harrington-Resistors:RES-V: Resistors - Vertical; POWER: 1/4W; TEMPERATURE: -55~155°C; VOLTAGE: 1.58V
R20 = Harrington-Resistors:RES-V: Resistors - Vertical; POWER: 1/10W; TEMPERATURE: -55~155°C; VOLTAGE: 18.2V
R21 R24-R26 = Harrington-Resistors:TRIMPOT-V: Trimming Potentiometers Bourns - Vertical
R22 R23 = Harrington-Resistors:RES-V: Resistors - Vertical; POWER: 1/10W; TEMPERATURE: -55~155°C; VOLTAGE: 15.5V
R27-R29 = Harrington-Resistors:RES-H: Resistors - Horizontal; POWER: 1/10W; TEMPERATURE: -55~155°C; VOLTAGE: 5.7V
SW1 = Harrington-Switches:BUTTON-V-SPST: SPST Button E-Switch - Vertical; I_MAX: 50mA; V_MAX: 12V
SW2 = Harrington-Switches:SWITCH-4PDT: 4PDT Switch E-Switch
TP1-TP14 = Harrington-Symbols:TEST-POINT: Test point
U1 = Harrington-ICs:ESP32-WROVER-E/IE: ESP32-WROVER-E/IE Espressif - ESP32 with 8MB PSRAM
U2 = Harrington-ICs:CP2102N-QFN28: CP2102N QFN28 Silicon Labs - CP2102N 28 pin variant with TXT and RXT
U3 U4 U8 = Harrington-ICs:TLV767-Q1: TLV767-Q1 Linear Regulator Texas Instruments - Input Voltage: 2.5-16V - Output Voltage: 0.8-14.6V - Max Current: 1A
U5 = Harrington-ICs:LM358B: LM358B Dual Op-amp Texas Instruments - Voltage Rails: 3-36V - Gain Bandwidth Product: 1.2MHz
U6 = Harrington-ICs:LM386: LM386 Audio Power Amplifier Texas Instruments - Voltage Rails: 4-12V
U7 = Harrington-ICs:TPL0401X-10: 10K Digital Potentiometer Texas Instruments - I2C Interface
U$122 = Harrington-Aesthetics:SIGNATURE: PCB Signature

## Board
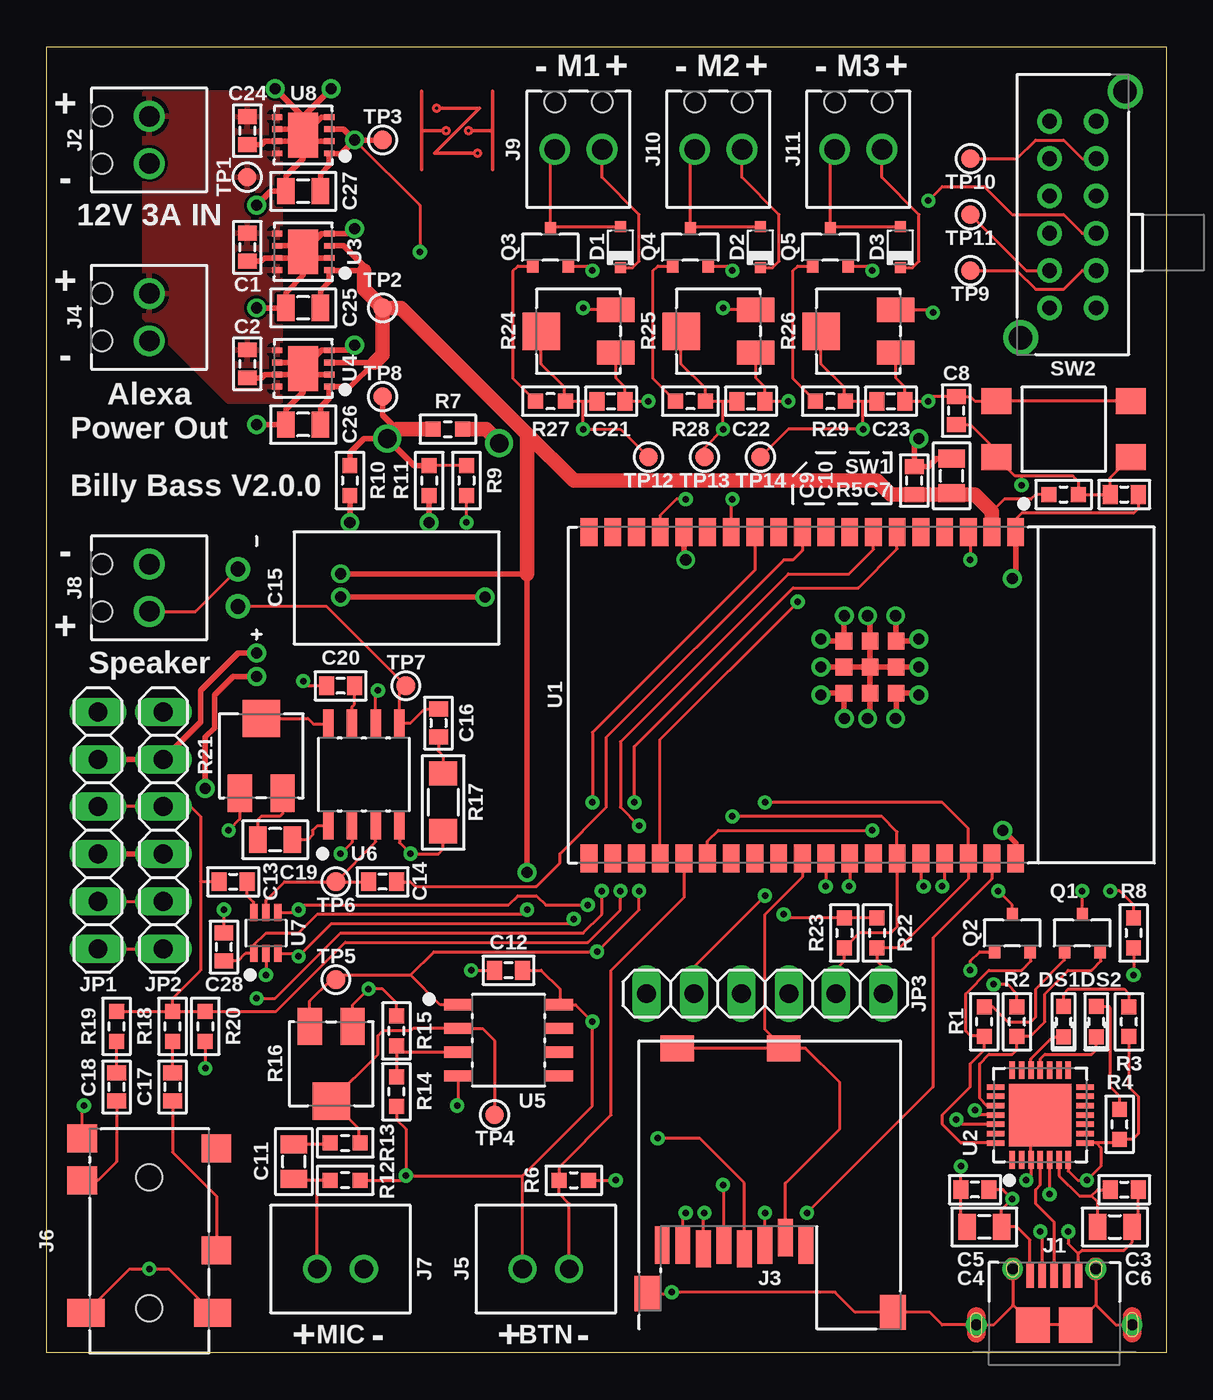
[diagram p4: board, top side]
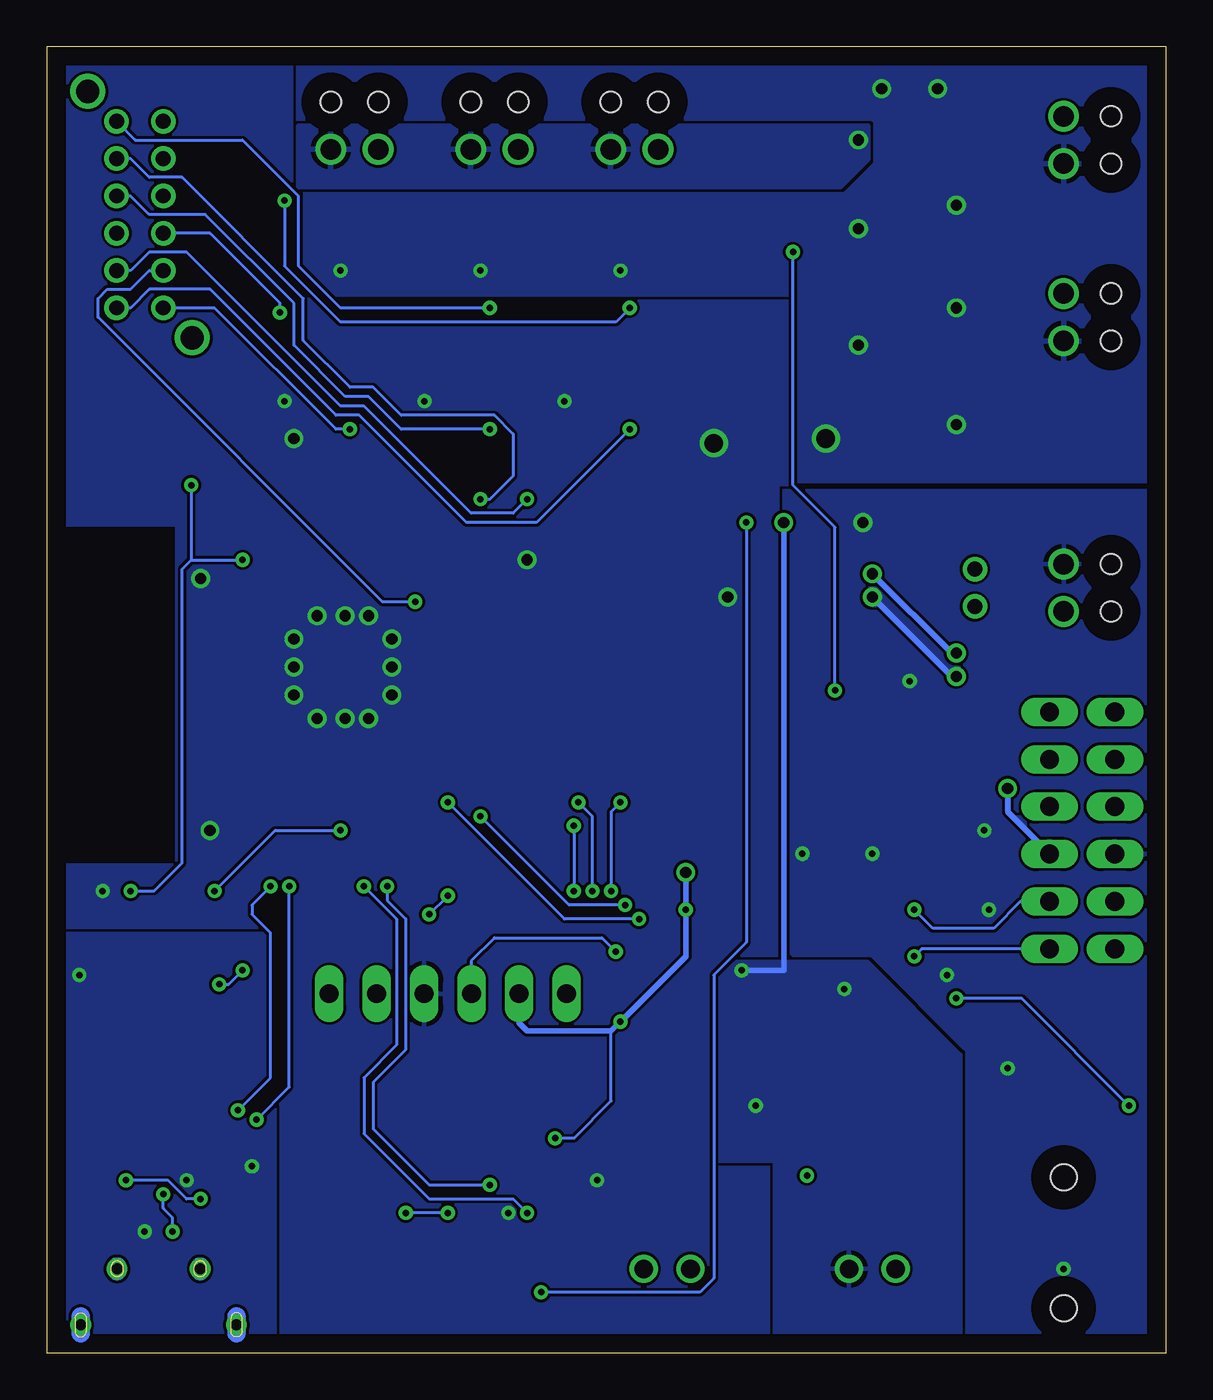
[diagram p5: board, bottom side, seen from below]

Size 60 x 70 mm. Coordinates in mm from the lower left corner, seen from the top.
Outline: 0,0 0,70 60,70 60,0 0,0
Copper layers (1*16): Top 0.035mm / dielectric 1.5mm / Bottom 0.035mm
Design rules "default": minimum track width 6mil, minimum drill 0.35mm, track to track 6mil, track to pad 6mil, pad to pad 6mil, via to via 6mil, smd to smd 6mil, copper to edge 40mil, drill to drill 6mil, minimum pad ring 10mil, minimum via ring 8mil, stop-mask expansion 4mil, vias tented up to drill 0mil, thermal gap 10mil

### Footprints (pad centres in the part's own frame; a part is rotated, then mirrored left to right if it is on the bottom)
1608-SEM = smd 0.8 x 1: 1 -0.75,0; 2 0.75,0
2012-SEM = smd 0.95 x 1.4: 1 -0.925,0; 2 0.925,0
6X11-E-FLAT-REV = drill 0.8: 1 1,0; 2 -1,0
SOD323 = smd 0.6 x 0.6: 1 -1.1,0; 2 1.1,0
1608 = smd 0.8 x 0.8: 1 -0.825,0; 2 0.825,0
47589-0001 = smd 0.4 x 1.35: 1 -1.3,2.675; 2 -0.65,2.675; 3 0,2.675; 4 0.65,2.675; 5 1.3,2.675 | drill 0.6 pad 0.9: SHIELD@1 -2.225,3; SHIELD@2 2.225,3; SHIELD@3 -4.175,0; SHIELD@6 4.175,0 | smd 1.8 x 1.9: SHIELD@4 -1.15,0; SHIELD@5 1.15,0
MPT-0.5/2-2.54 = drill 1.1: 1 0,1.27; 2 0,-1.27 | hole 1.1: -2.54,1.27; -2.54,-1.27
MEM2061 = smd 0.8 x 2: 1 1.94,-3.225; 2 0.84,-2.825; 3 -0.26,-3.225; 4 -1.36,-3.425; 5 -2.46,-3.225; 6 -3.56,-3.425; 7 -4.66,-3.225; 8 -5.76,-3.225 | smd 1.8 x 1.4: CD@1 -4.95,7.325; CD@2 0.75,7.325 | smd 1.4 x 1.9: SHIELD@1 -6.55,-5.825; SHIELD@2 6.6,-6.825
B2B-XH-A = drill 1: 1 -1.25,0; 2 1.25,0
SJ2-358940-SMT = smd 2 x 1.5: 1 -3.4,-2.15; 4 3.4,-2.15 | smd 1.6 x 1.5: 2 3.6,-9.25; 3 -3.6,-5.5; 10 3.6,-11.5; 11 -3.6,-10.95 | hole 1.4: 0,-2.4; 0,-9.4
1X06 = drill 1.016 long: 1 -6.35,0; 2 -3.81,0; 3 -1.27,0; 4 1.27,0; 5 3.81,0; 6 6.35,0
SOT-23 = smd 0.6 x 0.7: 1 0.95,1; 2 -0.95,1; 3 0,-1
1608-SEM' = smd 0.8 x 0.8: 1 -0.8,0; 2 0.8,0
3314J = smd 1.3 x 2: 1 -1.15,2; 3 1.15,2 | smd 2 x 2: 2 0,-2
3216-SEM = smd 1.3 x 1.5: 1 -1.55,0; 2 1.55,0
TL3305 = smd 1.6 x 1.4: 1 -3.6,-1.5; 2 3.6,-1.5; 3 -3.6,1.5; 4 3.6,1.5
EG4208 = drill 0.8: 1 -5,-1.25; 2 -3,-1.25; 3 -1,-1.25; 4 1,-1.25; 5 3,-1.25; 6 5,-1.25; 7 -5,1.25; 8 -3,1.25; 9 -1,1.25; 10 1,1.25; 11 3,1.25; 12 5,1.25 | drill 1.25: SHIELD@1 -6.6,2.8; SHIELD@2 6.6,-2.8
TEST-POINT = smd 1 x 1: TP 0,0
ESP32-WROVER-E/IE = smd 1.5 x 0.9: 1 -8.75,11.43; 2 -8.75,10.16; 3 -8.75,8.89; 4 -8.75,7.62; 5 -8.75,6.35; 6 -8.75,5.08; 7 -8.75,3.81; 8 -8.75,2.54; 9 -8.75,1.27; 10 -8.75,0; 11 -8.75,-1.27; 12 -8.75,-2.54; 13 -8.75,-3.81; 14 -8.75,-5.08; 15 -8.75,-6.35; 16 -8.75,-7.62; 17 -8.75,-8.89; 18 -8.75,-10.16; 19 -8.75,-11.43; 20 8.75,-11.43; 21 8.75,-10.16; 22 8.75,-8.89; 23 8.75,-7.62; 24 8.75,-6.35; 25 8.75,-5.08; 26 8.75,-3.81; 27 8.75,-2.54; 28 8.75,-1.27; 29 8.75,0; 30 8.75,1.27; 31 8.75,2.54; 32 8.75,3.81; 33 8.75,5.08; 34 8.75,6.35; 35 8.75,7.62; 36 8.75,8.89; 37 8.75,10.16; 38 8.75,11.43 | smd 0.9 x 0.9: PAD@1 -2.9,5.03; PAD@2 -1.5,5.03; PAD@3 -0.1,5.03; PAD@4 -2.9,3.63; PAD@5 -1.5,3.63; PAD@6 -0.1,3.63; PAD@7 -2.9,2.23; PAD@8 -1.5,2.23; PAD@9 -0.1,2.23
QFN28 = smd 0.95 x 0.3: 1 -2.4,1.5; 2 -2.4,1; 3 -2.4,0.5; 4 -2.4,0; 5 -2.4,-0.5; 6 -2.4,-1; 7 -2.4,-1.5; 15 2.4,-1.5; 16 2.4,-1; 17 2.4,-0.5; 18 2.4,0; 19 2.4,0.5; 20 2.4,1; 21 2.4,1.5 | smd 0.3 x 0.95: 8 -1.5,-2.4; 9 -1,-2.4; 10 -0.5,-2.4; 11 0,-2.4; 12 0.5,-2.4; 13 1,-2.4; 14 1.5,-2.4; 22 1.5,2.4; 23 1,2.4; 24 0.5,2.4; 25 0,2.4; 26 -0.5,2.4; 27 -1,2.4; 28 -1.5,2.4 | smd 3.35 x 3.35: PAD 0,0
VSON = smd 0.6 x 0.31: 1 -1.4,0.975; 2 -1.4,0.325; 3 -1.4,-0.325; 4 -1.4,-0.975; 5 1.4,-0.975; 6 1.4,-0.325; 7 1.4,0.325; 8 1.4,0.975 | smd 1.65 x 2.4: PAD 0,0
D0008A-SOIC = smd 1.55 x 0.6: 1 -2.7,1.905; 2 -2.7,0.635; 3 -2.7,-0.635; 4 -2.7,-1.905; 5 2.7,-1.905; 6 2.7,-0.635; 7 2.7,0.635; 8 2.7,1.905
SC70 = smd 0.4 x 0.9: 1 -0.65,-1.1; 2 0,-1.1; 3 0.65,-1.1; 4 0.65,1.1; 5 0,1.1; 6 -0.65,1.1

### Placement (x,y rotation side)
C1  10.75,59.25 270 top
C2  10.75,53 270 top
C3  100nF ± 5%  [1608-SEM]  57.75,8.75 0 top
C4  50.25,6.75 180 top
C5  100nF ± 5%  [1608-SEM]  49.75,8.75 180 top
C6  57.25,6.75 0 top
C7  100nF ± 5%  [1608-SEM]  57.75,46 0 top
C8  48.75,50.5 90 top
C9  100nF ± 5%  [1608-SEM]  46.5,46.75 90 top
C10  48.5,47 90 top
C11  13.25,10.25 90 top
C12  100nF ± 5%  [1608-SEM]  24.75,20.5 180 top
C13  10,25.25 0 top
C14  18,25.25 180 top
C15  10.25,41 270 top
C16  47nF ± 5%  [1608-SEM]  21,33.75 270 top
C17  6.75,14.25 90 top
C18  3.75,14.25 90 top
C19  12.25,27.5 180 top
C20  100nF ± 5%  [1608-SEM]  15.75,35.75 180 top
C21  100nF ± 5%  [1608-SEM]  30.25,51 0 top
C22  100nF ± 5%  [1608-SEM]  37.75,51 0 top
C23  100nF ± 5%  [1608-SEM]  45.25,51 0 top
C24  10.75,65.5 270 top
C25  13.75,56 180 top
C26  13.75,49.75 180 top
C27  13.75,62.25 180 top
C28  100nF ± 5%  [1608-SEM]  9.5,21.75 90 top
D1  30.75,59.25 90 top
D2  38.25,59.25 90 top
D3  45.75,59.25 90 top
DS1  54.5,17.75 90 top
DS2  56.25,17.75 90 top
J1  54,1.5 0 top
J2  5.5,65 0 top
J3  38.75,9 0 top
J4  5.5,55.5 0 top
J5  26.75,4.5 0 top
J6  5.5,0 180 top
J7  15.75,4.5 0 top
J8  5.5,41 0 top
J9  28.5,64.5 270 top
J10  36,64.5 270 top
J11  43.5,64.5 270 top
JP1  2.75,28 270 top
JP2  6.25,28 270 top
JP3  38.5,19.25 0 top
Q1  55.5,22.5 180 top
Q2  51.75,22.5 180 top
Q3  27,59.25 180 top
Q4  34.5,59.25 180 top
Q5  42,59.25 180 top
R1  10kΩ ± 1%  [1608-SEM']  50.25,17.75 90 top
R2  10kΩ ± 1%  [1608-SEM']  52,17.75 90 top
R3  10kΩ ± 1%  [1608-SEM']  58,17.75 90 top
R4  10kΩ ± 1%  [1608-SEM']  57.5,12.25 90 top
R5  10kΩ ± 1%  [1608-SEM']  54.5,46 0 top
R6  10kΩ ± 1%  [1608-SEM']  28.25,9.25 0 top
R7  0Ω + 50mΩ Max  [1608-SEM']  21.5,49.5 0 top
R8  0Ω + 50mΩ Max  [1608-SEM']  58.25,22.5 270 top
R9  0Ω + 50mΩ Max  [1608-SEM']  22.5,46.75 270 top
R10  0Ω + 50mΩ Max  [1608-SEM']  16.25,46.75 270 top
R11  0Ω + 50mΩ Max  [1608-SEM']  20.5,46.75 270 top
R12  10kΩ ± 1%  [1608-SEM']  16,9.25 180 top
R13  1kΩ ± 2%  [1608-SEM']  16,11.25 0 top
R14  10kΩ ± 1%  [1608-SEM']  18.75,14 90 top
R15  10kΩ ± 1%  [1608-SEM']  18.75,17.25 90 top
R16  15.25,15.5 0 top
R17  10Ω ± 2%  [3216-SEM]  21.25,29.5 270 top
R18  10kΩ ± 1%  [1608-SEM']  6.75,17.5 90 top
R19  10kΩ ± 1%  [1608-SEM']  3.75,17.5 90 top
R20  3.3kΩ ± 1%  [1608-SEM']  8.5,17.5 270 top
R21  11.5,32 180 top
R22  2.4kΩ ± 2%  [1608-SEM']  44.5,22.5 270 top
R23  2.4kΩ ± 2%  [1608-SEM']  42.75,22.5 270 top
R24  28.5,54.75 270 top
R25  36,54.75 270 top
R26  43.5,54.75 270 top
R27  330Ω ± 2%  [1608-SEM']  27,51 180 top
R28  330Ω ± 2%  [1608-SEM']  34.5,51 180 top
R29  330Ω ± 2%  [1608-SEM']  42,51 180 top
SW1  54.5,49.5 0 top
SW2  55,61 90 top
TP1  10.75,63 90 top
TP2  18,56 0 top
TP3  18,65 0 top
TP4  24,12.75 180 top
TP5  15.5,20 0 top
TP6  15.5,25.25 180 top
TP7  19.25,35.75 0 top
TP8  18,51.25 0 top
TP9  49.5,58 180 top
TP10  49.5,64 180 top
TP11  49.5,61 180 top
TP12  32.25,48 180 top
TP13  35.25,48 180 top
TP14  38.25,48 180 top
U1  40.5,35.25 270 top
U2  53.25,12.75 90 top
U3  13.75,59 180 top
U4  13.75,52.75 180 top
U5  24.75,16.75 0 top
U6  17,31 90 top
U7  11.75,22.5 0 top
U8  13.75,65.25 180 top
U$122  22,65.5 0 top

### Tracks (layer width: path | path; a pad name or v marks a point on that pad's centre or on a via)
3.3V  (via drill 0.35, 0.6)
  Top 0.152: R22.1 R23.1 39.7,23.3 v39.5,23.5 | J3.4 37.39,9.11 35,11.5 v32.75,11.5 | C12.1 26.5,20.5 27.5,19.5 27.5,18.66 U5.8 28.34,18.66 v29.25,17.75 29.25,13.25 25.5,9.5 | R12.1 19,9.25 v19.25,9.5 | R14.1 18.75,12.5 19.25,12 v19.25,9.5 | C28.1 10.25,21 10.65,21.4 U7.1 11.1,21.85 11.75,22.5 13.5,22.5 14.5,23.5 25.5,23.5 v25.75,23.75 | v19.25,9.5 25.5,9.5 | J5.1 25.5,9.5 | JP3.2 34.69,20.69 v38.5,24.5 | R5.1 53,46 52.75,45.75 51.32,45.75 50.66,45.09
  Top 0.3: C25.1 14.68,56.92 15.15,57.4 U3.1 15.18,58 17,58 17,58.25 15.93,59.33 U3.3 | C26.1 14.68,50.67 15.15,51.15 U4.1 16.27,51.77 17.57,53.08 U4.3 | JP1.2 JP2.2 8.25,33.81 8.25,35.5 10.25,37.5 v11.25,37.5 | v15.75,41.75 25.75,41.75 v25.75,25.75
  Top 0.781: 17.57,53.08 18,53.5 TP2.TP | TP2.TP 19,56 25.75,49.25 | 25.75,49.25 28.25,46.75 44.5,46.75 45.25,46 C9.1 48.5,46 | 48.5,46 49.75,46 50.66,45.09 U1.2 | C10.1 48.5,46 | 25.75,49.25 25.75,41.75 | 17,58 17,57 TP2.TP
  Bottom 0.152: 29.75,17.25 29.75,13.5 31.75,11.5 v32.75,11.5 | v39.5,23.5 v38.5,24.5
  Bottom 0.3: v11.25,37.5 11.5,37.5 v15.75,41.75 | v25.75,25.75 v25.75,23.75 25.75,21.25 v29.25,17.75 29.75,17.25 34.25,17.25 34.69,17.69 JP3.2
6.0V  (via drill 0.35, 0.6)
  Top 0.152: D3.1 46.4,58.15 46.75,58.5 46.75,61 44.75,63 44.75,64.48 J11.1 | D2.1 38.9,58.15 39.25,58.5 39.25,61 37.25,63 37.25,64.48 J10.1 | D1.1 31.4,58.15 31.75,58.5 31.75,61 29.75,63 29.75,64.48 J9.1 | v16.5,65 20,61.5 v20,59 | U6.6 17.64,35.38 v17.75,35.5
  Top 0.3: C27.1 14.68,63.17 15.15,63.65 U8.1 15.78,64.28 v16.5,65 | U8.3 15.93,65.58 v16.5,65 | TP3.TP v16.5,65
  Bottom 0.152: v17.75,35.5 17.75,44.25 20,46.5 v20,59
  pour Bottom: 16,65.75 16,64 17.5,62.5 46.5,62.5 46.5,65.75
12.0V
  pour Top: 5.25,67.5 5.25,55.5 9.75,51 12.5,51 12.5,67.5
AGND-0  (via drill 0.35, 0.6)
  Top 0.152: J6.4 4.45,4.5 v5.5,4.5 6.55,4.5 J6.1 | R20.2 v8.5,15.25 | C28.2 v9.5,23.75 | U7.2 v11.75,20.25 | R21.3 10.35,28.6 v9.75,28 | C20.2 14,35.75 v13.75,36 | U6.4 18.91,27.34 v19.5,26.75 21,26.75 21.25,27 R17.2 | U6.2 16.36,27.36 v15.75,26.75
  Top 0.3: v16.25,44.5 R10.2
  pour Bottom (rank 2): -1,46.25 -1,-1 10.75,-1 10.75,12 20.5,21.75 20.5,46.25
AGND-1  (via drill 0.35, 0.6)
  Top 0.152: R16.3 16.4,18.65 v17.25,19.5 18,19.5 18.75,18.75 R15.2 | v22.75,20.5 C12.2 | U5.4 22.05,13.3 v22,13.25
  Top 0.3: v20.5,44.5 R11.2
  Bottom 0.3: v20.5,44.5 20.5,20.5 v22.75,20.5
  pour Bottom: 11,16 11,-1 21,-1 21,10.25 24.25,10.25 24.25,21 16,21
AUDIO_INSERT-ESP32_IO27  (via drill 0.35)
  Top 0.152: J6.10 1.9,13.15 v2,13.25 | v11.25,19 12.25,19 15.75,22.5 28.75,22.5 29.75,23.5 v29.75,24.75 | v29.25,29.5 29.25,33.25 37.96,41.96 U1.12
  Bottom 0.152: v2,13.25 7.75,19 v11.25,19 | v29.75,24.75 29.75,29 v29.25,29.5
AUDIO_LEFT
  Top 0.152: C18.1 3.75,10.25 2.75,9.25 J6.2
AUDIO_MONO-ESP32_IO34  (via drill 0.35)
  Top 0.152: R18.2 R20.1 12.3,18.3 16,22 29,22 30.75,23.75 v30.75,24.75 | R19.2 R18.2 | R18.2 6.75,19 8.25,20.5 8.25,25.25 | JP1.3 JP2.3 7.73,29.27 8.25,28.75 8.25,25.25 | C13.1 8.25,25.25 | v31.5,29.5 31.5,32.5 40,41 43.5,41 45.58,43.08 U1.6
  Bottom 0.152: v30.75,24.75 30.75,28.75 v31.5,29.5
AUDIO_RIGHT
  Top 0.152: C17.1 6.75,10.75 9.1,8.4 J6.3
BUTTON-ESP32_IO2
  Top 0.152: J5.2 28,8 27.45,8.55 R6.1 27.45,9.95 30.25,12.75 30.25,20.5 34.15,24.4 U1.24
CHASSIS  (via drill 0.35)
  Top 0.152: J1.SHIELD@1 51.77,2.58 51.8,2.55 | 51.8,2.55 J1.SHIELD@4 J1.SHIELD@5 56.23,2.58 | J1.SHIELD@2 56.23,2.58 | 51.8,2.55 50.75,1.5 J1.SHIELD@3 48,1.5 47.33,2.17 J3.SHIELD@2 43.33,2.17 42.25,3.25 v33.5,3.25 33.42,3.17 J3.SHIELD@1 | 56.23,2.58 57.3,1.5 J1.SHIELD@6 | v22.5,44.5 R9.2
  Bottom 0.152: v22.5,44.5 22.5,22 24.25,20.25 24.25,4 25,3.25 v33.5,3.25
CP2102N_D+
  Top 0.152: J1.3 54,7 53,8 53,8.75 53.25,9 U2.4
CP2102N_D-  (via drill 0.35)
  Top 0.152: J1.2 53.35,6.4 v53.25,6.5 | v53.75,8.5 U2.5
  Bottom 0.152: v53.25,6.5 53.25,7.25 53.75,7.75 v53.75,8.5
CP2102N_DTR
  Top 0.152: Q2.2 52.75,21.45 52.75,21 52.25,20.5 50.5,20.5 49.25,19.25 49.25,17.25 49.5,17 50.2,17 R1.1 50.25,16.25 49.5,15.5 49.5,14.25 48,12.75 48,12.25 49,11.25 U2.28
CP2102N_RTS
  Top 0.152: U2.24 50.4,13.25 50,13.65 50,15.5 50.5,16 51.75,16 52,16.25 R2.1 52.05,17 52.75,17 53.5,17.75 53.5,19.25 54.75,20.5 56,20.5 56.5,21 56.5,21.45 Q1.2
CP2102N_RXD-ESP32_TXD  (via drill 0.35)
  Top 0.152: U2.25 50,12.75 v49.75,13 | U1.35 48.12,25.12 v48,25
  Bottom 0.152: v49.75,13 48,14.75 48,22.5 49,23.5 49,24 v48,25
CP2102N_RXT
  Top 0.152: U2.18 53.25,15.75 53.5,16 56,16 56.25,16.25 DS2.1
CP2102N_TXD-ESP32_RXD  (via drill 0.35)
  Top 0.152: U2.26 49,12.25 v48.75,12.5 | U1.34 46.85,25.15 v47,25
  Bottom 0.152: v48.75,12.5 47,14.25 v47,25
CP2102N_TXT
  Top 0.152: U2.19 52.75,15.75 53.92,16.93 DS1.1
CP2102N_VBUS  (via drill 0.35)
  Top 0.152: C5.1 51.25,8.75 v51.75,8.25 51.17,7.67 C4.1 52,6.75 52.7,6.05 J1.1 | U2.7 54.75,9.75 55.25,9.25 v55.75,9.25 56.5,10 56.5,11 56.25,11.25 | R3.1 58,14.25 58.5,13.75 58.5,11.75 58.2,11.45 R4.1 57.3,11.25 56.25,11.25 | 56.25,11.25 U2.8
  Bottom 0.152: v51.75,8.25 52.5,8.25 53.5,9.25 v55.75,9.25
CP2102N_VDD
  Top 0.152: U2.6 54.25,9.5 55.33,8.42 55.99,8.42 | 55.99,8.42 56.32,8.75 C3.1 | C6.1 56.33,8.08 55.99,8.42
DGND-0  (via drill 0.35, 0.6, 1)
  Top 0.152: R8.1 58.25,24 57.5,24.75 v57,24.75 | R6.2 v30.5,9.25 | J3.6 35.19,7.44 v35.25,7.5 | R24.3 30.5,52.25 31,51.75 C21.2 v32.25,51 | R25.3 38,52.25 38.5,51.75 C22.2 v39.75,51 | R26.3 45.5,52.25 46,51.75 C23.2 v47.25,51 47.5,51.25 C8.2 49.5,51.25 49.75,51 SW1.3 SW1.4 | C7.2 58.5,45.25 58.25,45 52.25,45 51.93,44.68 U1.1
  Top 0.3: JP1.4 JP2.4 | v8.5,30.25 8.5,33 9,33.5 9,35.25 10,36.25 v11.25,36.25 | U1.15 34.15,42.6 v34.25,42.5 | U1.1 51.93,41.68 v51.75,41.5 | v42.75,39.5 42.73,39.48 U1.PAD@7 41.6,38.15 v41.5,38.25 | v41.5,36.75 U1.PAD@8 U1.PAD@5 | v46.75,38.25 46.65,38.15 U1.PAD@1 45.5,38.18 v45.5,39.5 | v41.5,35.25 41.6,35.35 U1.PAD@9 42.73,34.02 v42.75,34 | v44,34 44.13,34.13 U1.PAD@6 U1.PAD@5 | v46.75,36.75 U1.PAD@2 U1.PAD@5 | U1.PAD@5 U1.PAD@4 44.13,39.37 v44,39.5 | U1.38 51.93,27.32 v51.25,28 | v45.5,34 45.53,34.03 U1.PAD@3 46.65,35.35 v46.75,35.25 | v15.75,40.5 v23.5,40.5 | v46.75,49 46.5,48.75 C9.2 47.25,47.5 47.67,47.92 C10.2
  Top 0.781: v24.25,48.75 24.25,48.8 23.55,49.5 R7.2
  Bottom 0.3: JP2.4 8.5,28.98 v8.5,30.25 | v15.75,40.5 11.5,36.25 v11.25,36.25
  pour Bottom (rank 3): -1.5,71.5 -1.5,-1.5 61.5,-1.5 61.5,71.5
DGND-1  (via drill 0.35)
  Top 0.152: J1.5 55.3,5.3 | 55.3,5.3 55.5,5.5 57.75,5.5 58.17,5.92 C6.2 58.5,7.08 C3.2 | 55.3,5.3 54.75,5.85 v54.75,6.5 | C4.2 49,7.08 C5.2 v49,10 | U2.PAD 52.75,12.25 U2.3 52.75,9.5 v52.5,9.25 | R8.2 v58.25,20.25
  pour Bottom: 47.75,22.5 47.75,-1 61,-1 61,22.5
DRIVE_SIGNAL_HEAD  (via drill 0.35)
  Top 0.152: R25.2 34,53 35.3,51.7 R28.1 36.25,51 | 36.25,51 C22.1 | 36.25,51 v36.25,49.5 35.25,48.5 TP13.TP
  Bottom 0.152: SW2.4 55.5,62 54.5,61 51.5,61 46.75,56.25 46.75,54 44,51.25 42.75,51.25 41,49.5 v36.25,49.5
DRIVE_SIGNAL_MOUTH  (via drill 0.35)
  Top 0.152: R24.2 26.5,53 27.75,51.75 27.75,51.05 R27.1 28.75,51 | 28.75,51 C21.1 | 28.75,51 v28.75,49.5 30.75,49.5 TP12.TP
  Bottom 0.152: SW2.1 55.5,56 54.5,57 51.25,57 44.5,50.25 43.25,50.25 37.5,44.5 33.75,44.5 v28.75,49.5
DRIVE_SIGNAL_TAIL  (via drill 0.35)
  Top 0.152: R26.2 41.5,53 42.75,51.75 42.75,51.05 R29.1 43.75,51 | 43.75,51 C23.1 | 43.75,51 v43.75,49.5 39.75,49.5 TP14.TP
  Bottom 0.152: v43.75,49.5 44.5,49.5 51,56 SW2.7
ESP32_EN  (via drill 0.35)
  Top 0.152: Q1.3 v55.5,24.75 | U1.3 49.5,43.89 v49.5,42.5 | SW1.2 57,46.9 C7.1 R5.2 55.3,46.7 55,47 52.25,47 | 52.25,47 51.9,47 SW1.1 50.9,48.35 49.5,49.75 C8.1 | v52.25,46.5 52.25,47
  Bottom 0.152: v55.5,24.75 54.25,24.75 52.75,26.25 52.75,42 52.25,42.5 | 52.25,42.5 v49.5,42.5 | v52.25,46.5 52.25,42.5
ESP32_IO0  (via drill 0.35)
  Top 0.152: Q2.3 51.75,24 v51,24.75 | U1.25 35.42,27.42 36,28 v44.25,28
  Bottom 0.152: v51,24.75 47.75,28 v44.25,28
ESP32_IO25
  Top 0.152: C14.1 19.5,25.25 19.75,25 26.25,25 27.5,26.25 27.5,26.75 30,29.25 30,33 39.5,42.5 40,42.5 40.5,43 U1.10
ESP32_SCL  (via drill 0.35)
  Top 0.152: JP3.6 44.85,20.65 44.5,21 R22.2 45.7,21.7 49.39,25.39 U1.36 49.39,28.11 48,29.5 v38.5,29.5 | JP1.6 JP2.6 | U7.3 13.35,21.4 v13.5,21.25 15.25,23 28,23 v28.25,23.25
  Bottom 0.152: JP2.6 13.1,21.65 v13.5,21.25 | v38.5,29.5 32.25,23.25 v28.25,23.25
ESP32_SDA  (via drill 0.35)
  Top 0.152: JP3.5 42.31,20.56 42.75,21 R23.2 43.55,22.5 45.25,22.5 45.58,22.83 U1.33 45.58,27.92 44.75,28.75 v36.75,28.75 | JP1.5 JP2.5 | U7.4 13.35,23.6 v13.5,23.75 13.75,24 24.75,24 25.25,24.5 26.25,24.5 26.75,24 v29,24
  Bottom 0.152: JP2.5 7.81,24.19 9.25,22.75 12.5,22.75 v13.5,23.75 | v29,24 32,24 v36.75,28.75
HEAD-
  Top 0.152: J10.2 34.5,64.27 Q4.3 34.6,60.35 D2.2
LM358_IN1+
  Top 0.152: R15.1 18.75,16.25 | 18.75,16.25 R14.2 | U5.3 18.89,16.11 18.75,16.25
LM358_IN1-
  Top 0.152: R13.2 16.75,11.3 16.75,12 R16.2 17.75,16 17.75,17 18,17.25 19.5,17.25 19.64,17.39 U5.2 23.36,17.39 24,16.75 TP4.TP
LM358_OUT1-ESP32_IO35  (via drill 0.35)
  Top 0.152: U5.1 21.09,18.66 19.5,20.25 | 19.5,20.25 15.75,20.25 TP5.TP 15.25,20 14.1,18.85 R16.1 | 19.5,20.25 20.75,21.5 v29.5,21.5 31.75,23.75 v31.75,24.75 | v31.75,28.25 30.75,29.25 30.75,32.75 39.75,41.75 43,41.75 44.31,43.06 U1.7
  Bottom 0.152: v29.5,21.5 30.25,22.25 36,22.25 37.25,21 37.25,19.27 JP3.3 | v31.75,28.25 v31.75,24.75
LM386M-G1
  Top 0.152: U6.1 15.04,28.25 14.5,28.25 14.25,28 14.25,27.75 14,27.5 C19.1
LM386M_BYPASS
  Top 0.152: U6.7 16.36,34.62 16.5,34.75 C20.1
LM386M_G8
  Top 0.152: R21.2 14,34 14.3,33.7 U6.8
LM386M_IN+
  Top 0.152: U7.5 11.75,24.25 12.75,25.25 TP6.TP | TP6.TP C14.2 | U6.3 17.64,27.39 TP6.TP
LM386M_OUT
  Top 0.152: C16.1 20.25,34.5 19.5,33.75 18.95,33.75 U6.5 18.91,35.41 TP7.TP 15,40 C15.1
MIC+
  Top 0.152: R12.2 14.5,9.25 | 14.5,9.25 13.32,9.25 C11.1 | J7.1 14.5,9.25
MOUTH-
  Top 0.152: J9.2 27,64.27 Q3.3 27.1,60.35 D1.2
N$3
  Top 0.152: R1.2 50.7,18.55 51.5,17.75 52.75,17.75 53,18 53,19.5 54.55,21.05 Q1.1
N$4  (via drill 0.35)
  Top 0.152: R2.2 52,19.25 51.5,19.75 v50.75,19.75 | v49.5,20.5 49.5,21 50,21.5 Q2.1
  Bottom 0.152: v50.75,19.75 50.25,19.75 v49.5,20.5
N$5
  Top 0.152: DS1.2 54.5,19.25 54.75,19.5 57.75,19.5 58,19.25 R3.2
N$6
  Top 0.152: DS2.2 56.92,18.57 57,18.5 57,14.25 57.5,13.75 R4.2
N$10
  Top 0.152: R13.1 15.12,11.18 C11.2
N$15
  Top 0.152: C16.2 21,32.25 21.25,32 R17.1
N$16
  Top 0.152: R27.2 25,52.2 25,58 25.25,58.25 Q3.1
N$17
  Top 0.152: C17.2 R18.1
N$18
  Top 0.152: C18.2 R19.1
N$20
  Top 0.152: R28.2 32.5,52.2 32.5,58 32.75,58.25 Q4.1
N$21
  Top 0.152: R21.1 12.65,28.9 12.5,28.75 11.5,28.75 11.32,28.57 C19.2
N$23
  Top 0.152: R29.2 40,52.2 40,58 40.25,58.25 Q5.1
PGND  (via drill 0.35, 0.6, 1)
  Top 0.152: Q3.2 29,58.25 v29.25,58 | Q4.2 36.5,58.25 v36.75,58 | Q5.2 44,58.25 v44.25,58 | R9.1 R11.1
  Top 0.3: U8.PAD 13.43,64.92 U8.7 11.68,64.92 11.5,64.75 C24.2 | U8.6 13.43,65.58 U8.PAD | U8.2 14.07,64.92 U8.PAD | U8.4 14.72,66.22 U8.PAD | v12.25,67.75 13.75,66.25 | 13.75,66.25 U8.PAD | v15.25,67.75 13.75,66.25 | U8.PAD 13.75,64 12.82,63.08 C27.2 12,62.25 v11.25,61.5 | C1.2 11.5,58.5 11.68,58.67 U3.7 13.43,58.67 U3.PAD | C2.2 11.5,52.25 11.68,52.42 U4.7 13.43,52.42 U4.PAD | U4.6 13.43,53.08 U4.PAD | U4.2 14.07,52.42 U4.PAD | U4.PAD 14.72,53.73 U4.4 16.23,53.73 v16.5,54 | U4.PAD 13.75,51.5 12.82,50.58 C26.2 v11.25,49.75 | v11.25,56 C25.2 12.82,56.83 13.75,57.75 U3.PAD | U3.6 13.43,59.33 U3.PAD | U3.2 14.07,58.67 U3.PAD | U3.PAD 14.72,59.98 U3.4 16.23,59.98 v16.5,60.25 | R10.1 16.25,48.25 17,49 v18.25,49 19.7,47.55 R11.1 | TP8.TP 18,50.25 18.75,49.5
  Top 0.781: R7.1 18.75,49.5 v18.25,49
  pour Bottom (rank 2): -1,71 -1,46.75 20,46.75 20,56.75 46.5,56.75 46.5,71
PWM_HEAD  (via drill 0.35)
  Top 0.152: R25.1 36.35,55.9 v36.25,56
  Bottom 0.152: SW2.6 55.25,65 49.5,65 46.5,62 46.5,58.25 44.25,56 v36.25,56
PWM_HEAD-ESP32_IO14  (via drill 0.35)
  Top 0.152: TP10.TP 52,64 53,65 54.5,65 55.5,64 SW2.5 | U1.13 36.69,45.69 v36.75,45.75
  Bottom 0.152: SW2.5 55.5,64 54.5,63 52.75,63 46.25,56.5 46.25,54.25 43.75,51.75 42.5,51.75 41,50.25 36,50.25 35,49.25 35,47 36.25,45.75 v36.75,45.75
PWM_MOUTH  (via drill 0.35)
  Top 0.152: R24.1 28.85,55.9 v28.75,56 | v47.25,61.75 48,62.5 50.25,62.5 51.75,61 54.5,61 55.5,60 SW2.3
  Bottom 0.152: v28.75,56 29.5,55.25 44.25,55.25 47.25,58.25 v47.25,61.75
PWM_MOUTH-ESP32_IO13  (via drill 0.35)
  Top 0.152: TP9.TP 52,58 53,57 54.5,57 55.5,58 SW2.2 | v34.25,45.75 33.75,45.75 32.88,44.88 U1.16
  Bottom 0.152: v34.25,45.75 35,45 37.25,45 43,50.75 44.25,50.75 52.5,59 54.5,59 55.5,58 SW2.2
PWM_TAIL  (via drill 0.35)
  Top 0.152: v47.5,55.75 47.35,55.9 R26.1
  Bottom 0.152: v47.5,55.75 47.5,56.25 51.25,60 SW2.9
PWM_TAIL-ESP32_IO15  (via drill 0.35)
  Top 0.152: TP11.TP 52.5,58 SW2.8 | U1.23 32.88,32.88 v40.25,40.25
  Bottom 0.152: SW2.8 54.5,58 55.5,57 56.75,57 57.25,56.5 57.25,55.5 42,40.25 v40.25,40.25
SD_CLK-ESP32_IO18  (via drill 0.35)
  Top 0.152: U1.30 41.77,25.02 v41.75,25 | J3.5 36.29,8.96 v36.25,9
  Bottom 0.152: v41.75,25 41.75,24.25 40.76,23.26 40.76,16.24 42.5,14.5 42.5,12 39.5,9 v36.25,9
SD_CS-ESP32_IO5
  Top 0.152: J3.2 39.59,9.09 42.5,12 42.5,14.5 40.67,16.32 J3.CD@2 | U1.29 40.5,25.5 38.5,23.5 38.5,17.32 J3.CD@2 | J3.CD@2 J3.CD@1
SD_MISO-ESP32_IO19  (via drill 0.35)
  Top 0.152: U1.31 43.04,25.04 v43,25 | J3.7 34.09,7.34 v34.25,7.5
  Bottom 0.152: v43,25 41.25,23.25 41.25,16.5 43,14.75 43,11.75 39.5,8.25 35,8.25 v34.25,7.5
SD_MOSI-ESP32_IO23  (via drill 0.35)
  Top 0.152: J3.3 v38.49,7.49 v38.5,7.5 | U1.37 50.66,25.41 47.5,22.25 47.5,14.25 v40.75,7.5
  Bottom 0.152: v38.5,7.5 v40.75,7.5
SPEAKER+
  Top 0.152: J8.2 7.98,39.73 C15.2
TAIL-
  Top 0.152: J11.2 42,64.27 Q5.3 42.1,60.35 D3.2
TPL0401_H
  Top 0.152: U7.6 11.1,24.15 10.75,24.5 C13.2

### Text on the board
tPlace: - | M1 | + | - | M2 | + | - | M3 | + | + | - | 12V 3A IN | + | - | Alexa / Power Out | Billy Bass V2.0.0 | - | + | Speaker | + | MIC | - | + | BTN | -
tDocu: PGND | 6.0V | AGND-1 | AGND-1 | DGND-1 | DGND-0